# EasyEDA Pro project 14届蓝桥杯省赛真题.epro

# Schematic B1

## Sheets
1 ETH: Create Date: 2023-03-16; Page Name: ETH; Project Name: 14省赛; Schematic Name: B1; Update Date: 2023-05-20
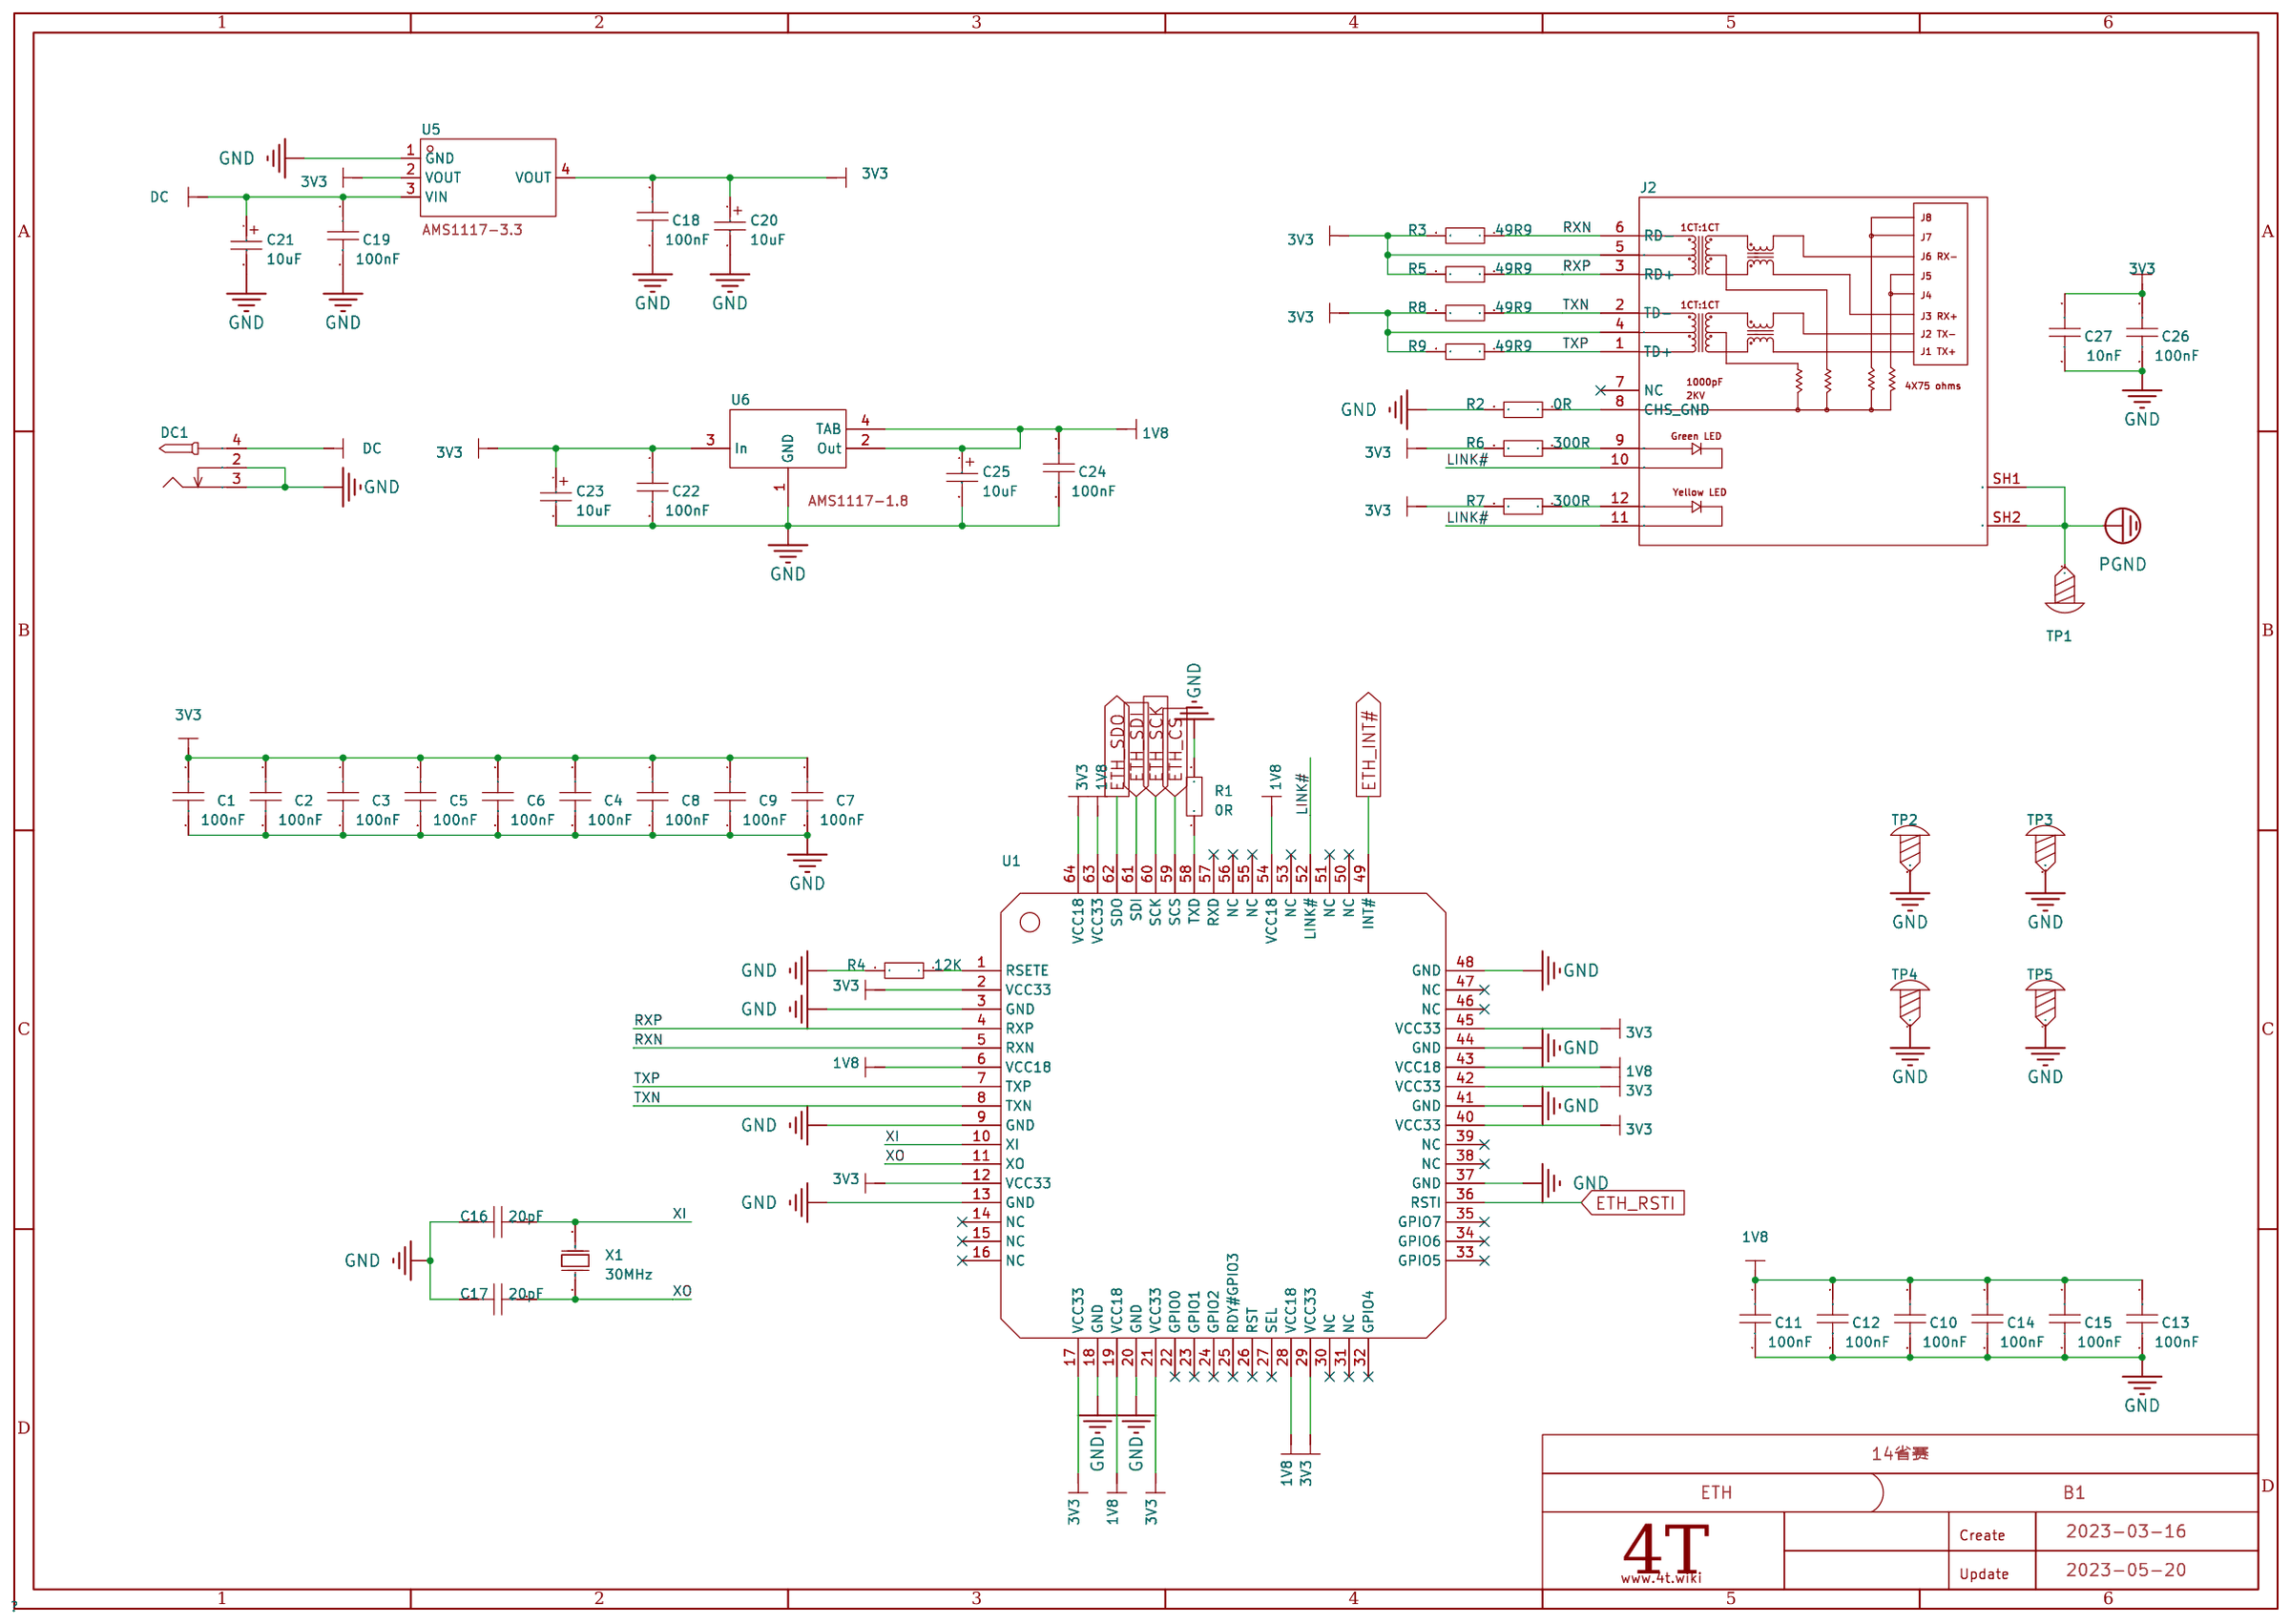
[diagram p0: ETH]
2 MP: Page Name: MP
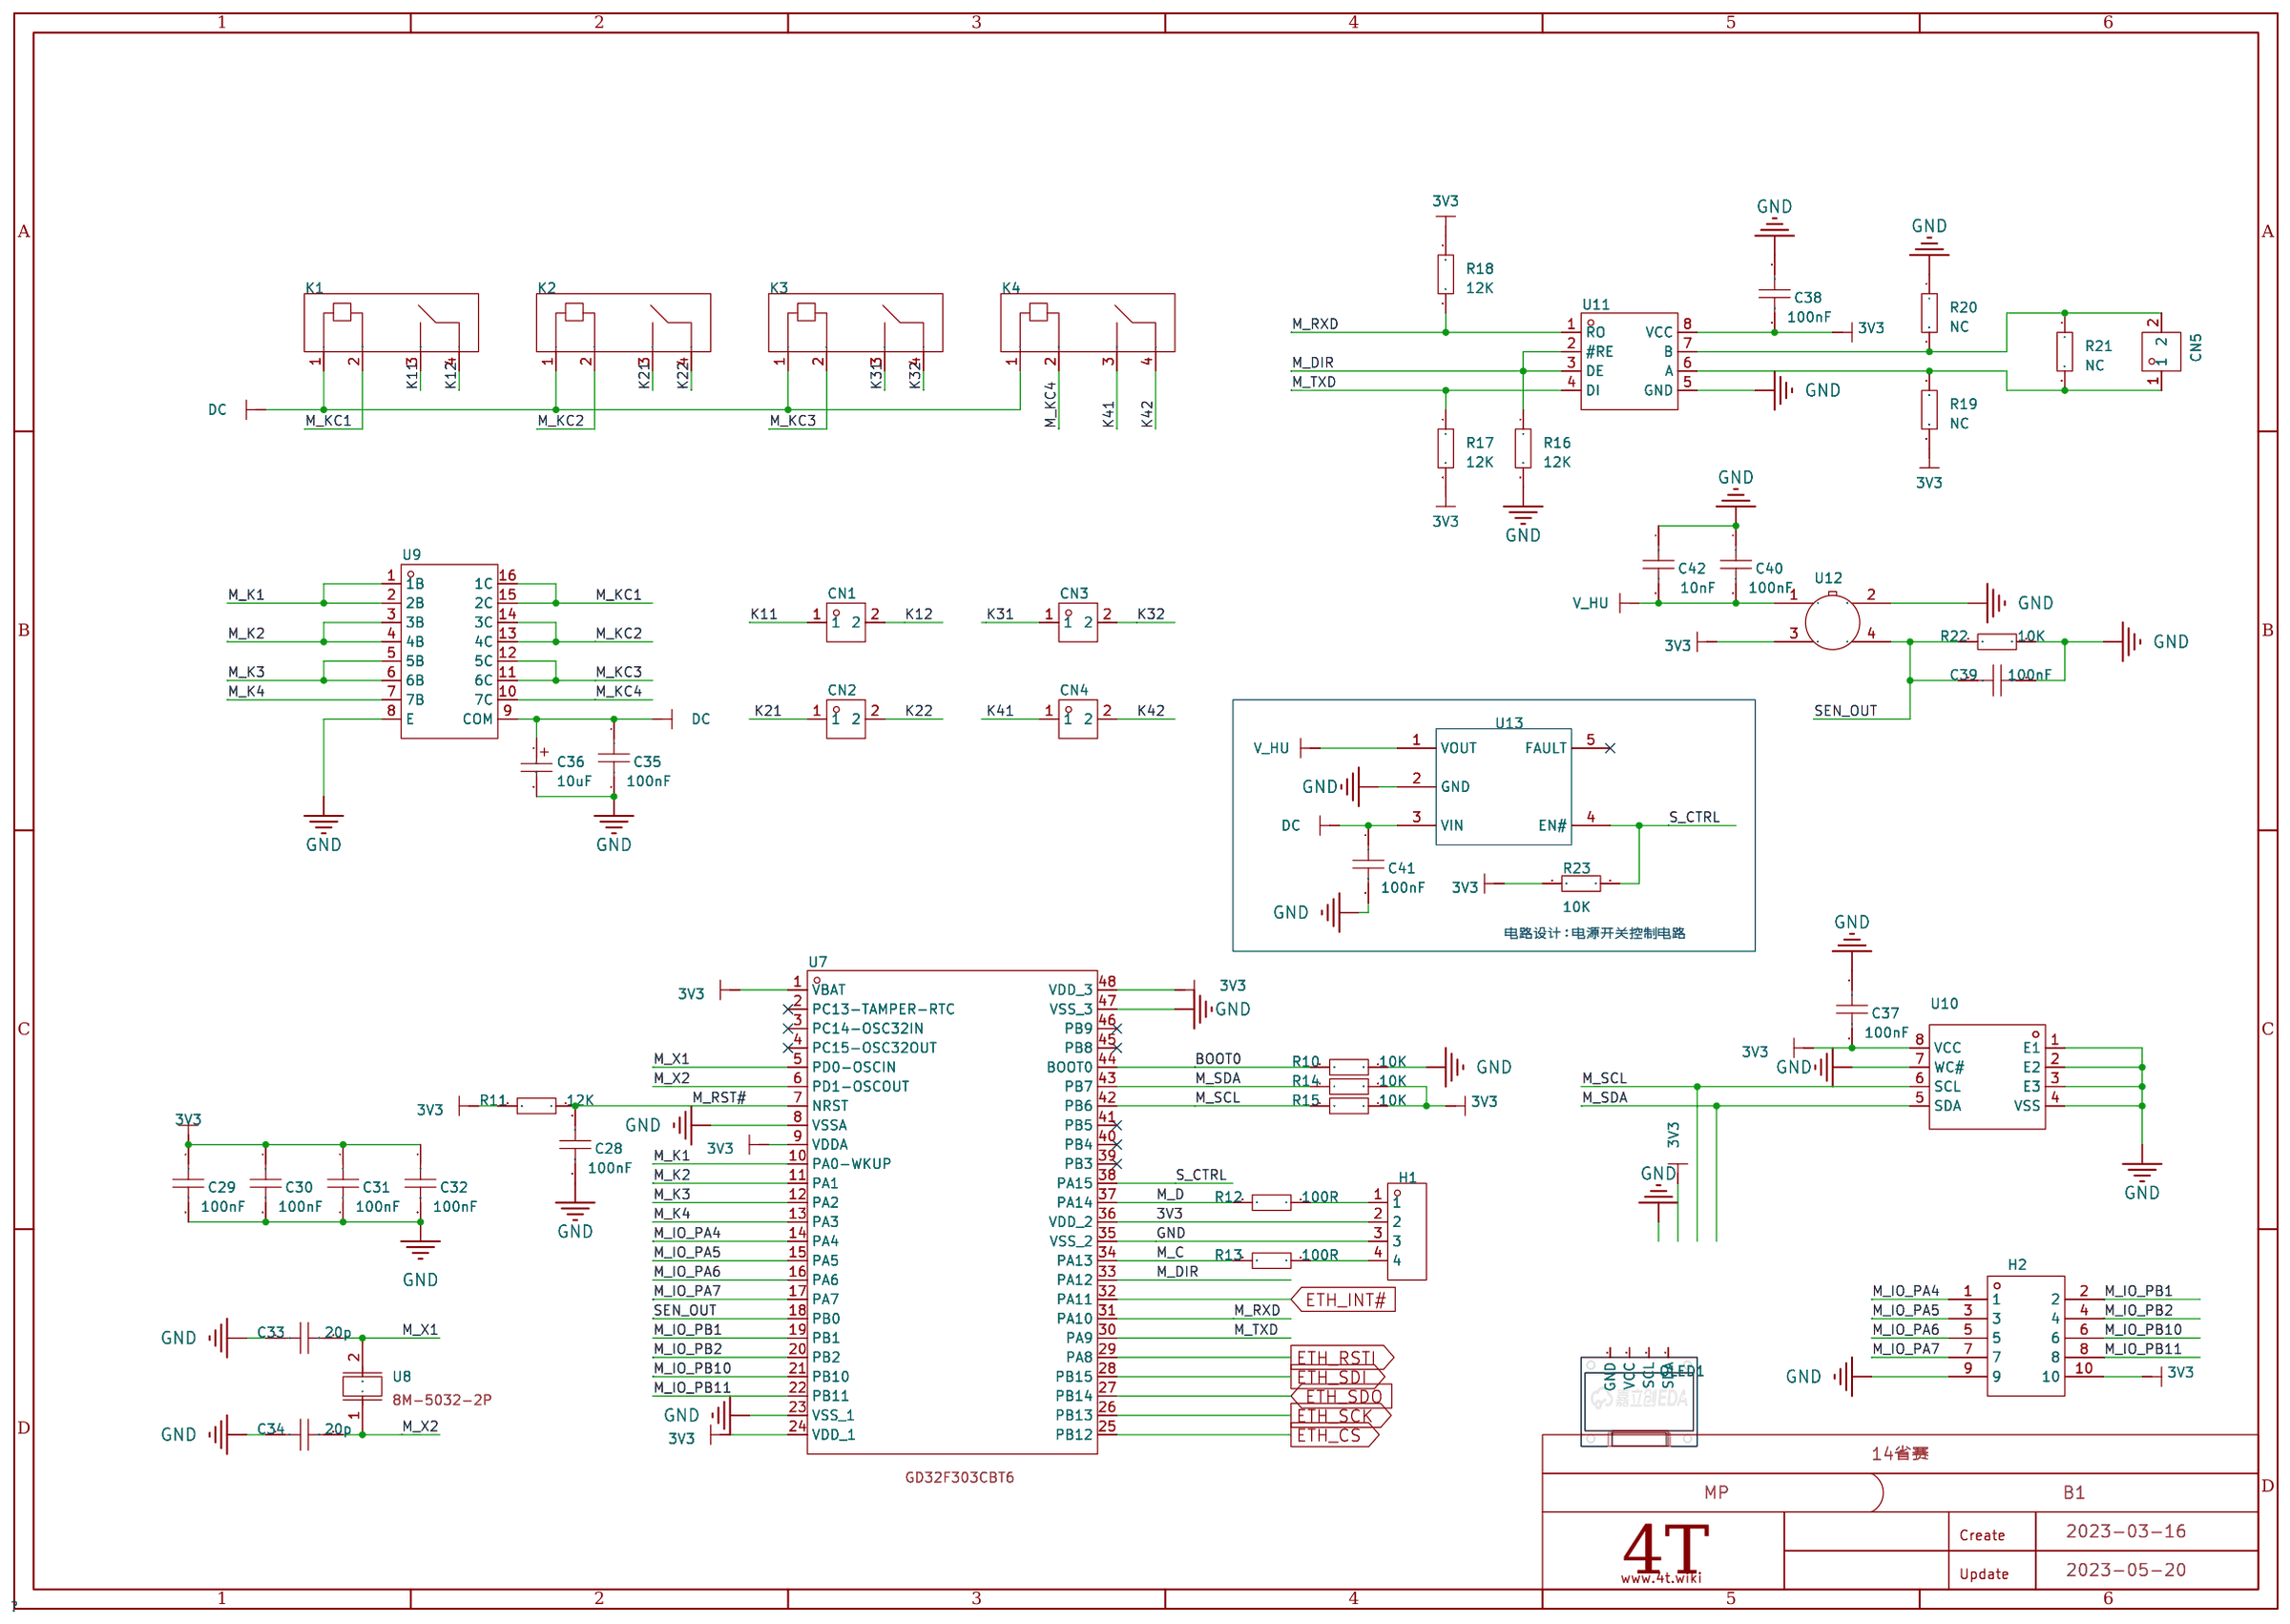
[diagram p1: MP]

## Parts
sheet ETH
C1  100nF  [C0805]
C2  100nF  [C0805]
C3  100nF  [C0805]
C4  100nF  [C0805]
C5  100nF  [C0805]
C6  100nF  [C0805]
C7  100nF  [C0805]
C8  100nF  [C0805]
C9  100nF  [C0805]
C10  100nF  [C0805]
C11  100nF  [C0805]
C12  100nF  [C0805]
C13  100nF  [C0805]
C14  100nF  [C0805]
C15  100nF  [C0805]
C16  20pF  [C0805]
C17  20pF  [C0805]
C18  100nF  [C0805]
C19  100nF  [C0805]
C20  10uF  [C_Ele_SMD_3x5.4mm]
C21  10uF  [C_Ele_SMD_3x5.4mm]
C22  100nF  [C0805]
C23  10uF  [C_Ele_SMD_3x5.4mm]
C24  100nF  [C0805]
C25  10uF  [C_Ele_SMD_3x5.4mm]
C26  100nF  [C0805]
C27  10nF  [C0805]
DC1  -  [DC-2.0]
J2  HY911105AE  [RJ45-TH_HR911105A]
R1  0R  [R0805]
R2  0R  [R0805]
R3  49R9  [R0805]
R4  12K  [R0805]
R5  49R9  [R0805]
R6  300R  [R0805]
R7  300R  [R0805]
R8  49R9  [R0805]
R9  49R9  [R0805]
TP1  -  [M3螺丝]
TP2  -  [M2螺丝]
TP3  -  [M2螺丝]
TP4  -  [M2螺丝]
TP5  -  [M2螺丝]
U1  CH395Q  [LQFP-64_L10.0-W10.0-P0.50-LS12.0-BL]
U5  AMS1117-3.3  [SOT-223-3_L6.5-W3.4-P2.30-LS7.0-BR]
U6  AMS1117-1.8  [SOT-223-4_L6.5-W3.5-P2.30-LS7.0-BR]
X1  30MHz  [OSC-SMD_L5.0-W3.2]
sheet MP
C28  100nF  [C0805]
C29  100nF  [C0805]
C30  100nF  [C0805]
C31  100nF  [C0805]
C32  100nF  [C0805]
C33  20p  [C0805]
C34  20p  [C0805]
C35  100nF  [C0805]
C36  10uF  [C_Ele_SMD_3x5.4mm]
C37  100nF  [C0805]
C38  100nF  [C0805]
C39  100nF  [C0805]
C40  100nF  [C0805]
C41  100nF  [C0805]
C42  10nF  [C0805]
CN1  KF128L-5.08-2P 蓝色  [TH_KF128L-5.08-2P]
CN2  KF128L-5.08-2P 蓝色  [TH_KF128L-5.08-2P]
CN3  KF128L-5.08-2P 蓝色  [TH_KF128L-5.08-2P]
CN4  KF128L-5.08-2P 蓝色  [TH_KF128L-5.08-2P]
CN5  KF128L-5.08-2P 蓝色  [TH_KF128L-5.08-2P]
H1  -  [HDR-TH_4P-P2.54-V-F]
H2  -  [HDR-TH_10P-P2.54-V-M-R2-C5-S2.54]
K1  HF49FD/012-1H12  [RELAY-TH_HF49FD-XXX-1H12-XXX]
K2  HF49FD/012-1H12  [RELAY-TH_HF49FD-XXX-1H12-XXX]
K3  HF49FD/012-1H12  [RELAY-TH_HF49FD-XXX-1H12-XXX]
K4  HF49FD/012-1H12  [RELAY-TH_HF49FD-XXX-1H12-XXX]
OLED1  -  [0.96OLED_4P]
R10  10K  [R0805]
R11  12K  [R0805]
R12  100R  [R0805]
R13  100R  [R0805]
R14  10K  [R0805]
R15  10K  [R0805]
R16  12K  [R0805]
R17  12K  [R0805]
R18  12K  [R0805]
R19  NC  [R0805]
R20  NC  [R0805]
R21  NC  [R0805]
R22  10K  [R0805]
R23  10K  [R0805]
U7  GD32F303CBT6  [LQFP-48_L7.0-W7.0-P0.50-LS9.0-BL]
U8  8M-5032-2P  [CRYSTAL-SMD_L5.0-W3.2]
U9  ULN2003  [SOIC-16_L9.9-W3.9-P1.27-LS6.0-BL]
U10  M24C02-WMN6TP  [SOIC-8_L4.9-W3.9-P1.27-LS6.0-BL]
U11  MAX3485ESA  [SOP-8_L5.0-W4.0-P1.27-LS6.0-BL]
U12  MP-2  [SENSOR-TH_MP-5]
U13  -  [SOT_PDS]

## Library data of the parts
C1-C19 C22 C24 C26-C35 C37-C42 = CAP_0603: Supplier Footprint: 0603
C20 C21 C23 C25 C36 = C_Ele_SMD_3x5.4mm: Supplier Footprint: SMD,3x5.4mm
DC1 = DC-005_2.0: Supplier Footprint: 插件
J2 = HY911105AE: 连接器类型:RJ插座;USOC代码:RJ45;端口数量:1;等级:-;屏蔽:-;LED:-;; LCSC Part Name: RJ45 带变压器; Supplier Part: C69427; Manufacturer: HANRUN(汉仁); Supplier Footprint: 插件; JLCPCB Part Class: 扩展库; Datasheet: https://atta.szlcsc.com/upload/public/pdf/source/20160507/1462613611469.pdf; Supplier: LCSC; Connector Type: RJ插座; USOC Codes: RJ45; Number of Ports: 1
R1-R23 = Res_0805: Supplier Footprint: 0805
TP1 = M3螺丝: Supplier Footprint: 插件
TP2-TP5 = M2螺丝: Supplier Footprint: 插件
U1 = CH395Q: 应用功能:以太网控制器;通道数:-;接口类型:Parallel, SPI, UART;电源电压:1.65V~3.6V;电源电流:90mA;; Supplier Part: C87390; Manufacturer: WCH(南京沁恒); Supplier Footprint: LQFP-64(10x10); JLCPCB Part Class: 扩展库; Datasheet: https://atta.szlcsc.com/upload/public/pdf/source/20200903/C87390_2BA27438C515B4B897A780BE99160E01.pdf; Supplier: LCSC; Application Function: 以太网控制器; Interface: Parallel, SPI, UART; Supply Voltage: 1.65V~3.6V; Supply Current: 90mA
U5 = AMS1117-3.3_C6186: 输出类型:固定;输出极性:正;输出通道数:1;最大输入电压:-;输出电压:3.3V;压差:1.3V@(800mA);静态电流(地电流):-;输出电流:1A;电源纹波抑制比(PSRR):72dB@(120Hz);噪声:-;特性:-;工作温度:-;; LCSC Part Name: 正 Vout=3.3V 1A 72dB@(120Hz); Supplier Part: C6186; Manufacturer: AMS; Supplier Footprint: SOT-223-3; JLCPCB Part Class: 基础库; Datasheet: https://atta.szlcsc.com/upload/public/pdf/source/20180727/C6186_7A095716F0823C02F1997A905E26C086.pdf; Supplier: LCSC; Output Type: 固定; Output Polarity: 正; Number of Outputs: 1; Output Voltage: 3.3V; Dropout Voltage: 1.3V@(800mA); Output Current: 1A; Power Supply Rejection Ratio (PSRR): 72dB@(120Hz)
U6 = AMS1117-1.8_C6185: 输出类型:固定;输出极性:正;输出通道数:1;最大输入电压:15V;输出电压:1.8V~1.8V;压差:1.3V@(1A);输出电流:1A;电源纹波抑制比(PSRR):75dB@(120Hz);; LCSC Part Name: 正 Vin=15V Vout=1.8V~1.8V 1A 75dB@(120Hz); Supplier Part: C6185; Manufacturer: AMS; Supplier Footprint: SOT-223-4; JLCPCB Part Class: 扩展库; Datasheet: https://atta.szlcsc.com/upload/public/pdf/source/20180727/C6186_7A095716F0823C02F1997A905E26C086.pdf; Supplier: LCSC; Output Type: 固定; Output Polarity: 正; Number of Outputs: 1; Maximum Input Voltage: 15V; Output Voltage: 1.8V~1.8V; Dropout Voltage: 1.3V@(1A); Output Current: 1A; Power Supply Rejection Ratio (PSRR): 75dB@(120Hz)
X1 = X503230MSB2GI: 晶振类型:贴片无源晶振;频率:30MHz;频率公差:±10ppm;频率稳定度:±50ppm;负载电容:20pF;工作温度:-40℃~+85℃;; LCSC Part Name: YSX530GA 30MHz ±10ppm 20pF; Supplier Part: C112563; Manufacturer: YXC(扬兴晶振); Supplier Footprint: SMD5032-2P; JLCPCB Part Class: 扩展库; Datasheet: https://atta.szlcsc.com/upload/public/pdf/source/20210329/C112559_847D3CACBA33ACCEB57DEA3AEBB187A1.pdf; Supplier: LCSC; Crystal Type: 贴片无源晶振; Frequency Tolerance: ±10ppm; Frequency Stability: ±50ppm; Load Capacitance: 20pF; Operating Temperature: -40℃~+85℃
CN1-CN5 = KF128L-5.08-2P 蓝色: Supplier Part: C2916931; Supplier Footprint: 5.08-2P; JLCPCB Part Class: 扩展库; Supplier: LCSC
H1 = HDR-F_2.54_1x4P: Supplier Part: C2718488; Supplier Footprint: 插件
H2 = HDR-M_2.54_2x5: Supplier Part: C124387; Supplier Footprint: 插件,P=2.54mm
K1-K4 = HF49FD/012-1H12: 线圈电压:12V;线圈类型:非极化-单线圈;触点形式:一组常开:1A(单刀单掷-常开);最大切换电流:5A;触点材料:AgNi;; LCSC Part Name: 宏发继电器; Supplier Part: C399491; Manufacturer: HF(宏发); Supplier Footprint: SIP-4; JLCPCB Part Class: 扩展库; Datasheet: https://atta.szlcsc.com/upload/public/pdf/source/20190620/C399491_B2190B02DDD565265172868420E7880D.pdf; Supplier: LCSC; Coil Voltage: 12V; Coil Type: 非极化-单线圈; Pin Number: 4; Contact Form: 一组常开:1A(单刀单掷-常开); Maximum Switching Current: 5A; Maximum Switching Voltage: 250V@AC；30V@DC; Coil Rated Power: 120mW; Contact Rating: 5A@30VDC；5A@250VAC; Coil Resistance: 1.2kΩ; Operate Time: 10ms; Release Time: 5ms; Contact Resistance: 100mΩ; Contact Material: AgNi; Operating Temperature: -40℃~+85℃
OLED1 = 0.96OLED模块_4P: Supplier Footprint: 插件
U7 = GD32F303CBT6_C3013779: CPU内核:ARM Cortex-M4;CPU最大主频:120MHz;工作电压范围:-;程序存储容量:128KB;RAM总容量:32KB;EEPROM/数据 FLASH容量:128KB;GPIO端口数量:37;ADC(位数):12bit;DAC(位数):12bit;(E)PWM(位数):-;8位Timer数量:-;16位Timer数量:7;32位Timer数量:-;CAN路数:1;U(S)ART路数:3;I2C路数:2;I2S路数:2;(Q)SPI路数:3;外设/功能:看门狗；RTC实时时钟;内部振荡器:; LCSC Part Name: ARM Cortex-M4 120MHz; Supplier Part: C3013779; Manufacturer: GigaDevice(兆易创新); Supplier Footprint: LQFP-48(7x7); JLCPCB Part Class: 扩展库; Datasheet: https://atta.szlcsc.com/upload/public/pdf/source/20220624/E1A57ED816B162D6D1424864911A792F.pdf; Supplier: LCSC; CPU Core: ARM Cortex-M4; CPU Maximum Speed: 120MHz; Program Storage Size: 128KB; Program Memory Type: FLASH; RAM Size: 32KB; EEPROM: 128KB; GPIO Ports Number: 37; ADC (Bit): 12bit; DAC (Bit): 12bit; 16Bit Timer: 7; CAN: 1; UART/USART: 3; I2C: 2; I2S: 2; SPI: 3; Peripheral/Function: 看门狗；RTC实时时钟; Watchdog: 有; Real-Time Clock: 有
U8 = 8M-5032-2P: Supplier Part: C9900017580; Supplier Footprint: 8MHz; JLCPCB Part Class: 扩展库; Supplier: LCSC
U9 = ULN2003: 开态输入电压(VI(on)@Vce,Ic):3V@2V,300mA;集射极饱和压降(VCE(sat)@Ii,Ic):1.2V@500uA,350mA;输出漏电流(Icex@Vce):50uA@50V;开态输入电流(Ii@Vi):-;关态输入电流(Ii(off)@Vce,Ic):65uA@50V,500uA;嵌位二极管漏电流(IR@VR):50uA@50V;嵌位二极管正向压降(VF@IF):1.7V@350mA;输入电容(Ci):15pF;工作温度:-20℃~+85℃;; Supplier Part: C688859; Manufacturer: IDCHIP(英锐芯); Supplier Footprint: SOIC-16; JLCPCB Part Class: 扩展库; Datasheet: https://atta.szlcsc.com/upload/public/pdf/source/20210302/C688859_5C67C6CBB0EA78EF92AFC966B53E1AD0.pdf; Supplier: LCSC; ON-state input   voltage(VI(on)@Vce,Ic): 3V@2V,300mA; Collector-emitter   saturation voltage (VCE(sat)@Ii,Ic): 1.2V@500uA,350mA; Output leakage current (Icex@Vce): 50uA@50V; Off-state input current (Ii(off)@Vce,Ic): 65uA@50V,500uA; Clamp Diode Leakage Current (IR@VR): 50uA@50V; Clamp Diode Forward Voltage (VF@IF): 1.7V@350mA; Input Capacitance (Ci): 15pF; Operating Temperature: -20℃~+85℃
U10 = M24C02-WMN6TP: 2-Kbit(256 x 8bit)，I2C接口，工作电压：2.5V to 5.5V; Supplier Part: C7562; Manufacturer: ST(意法半导体); Supplier Footprint: SOIC-8; JLCPCB Part Class: 基础库; Datasheet: https://atta.szlcsc.com/upload/public/pdf/source/20140724/1457707167301.pdf; Supplier: LCSC
U11 = MAX3485ESA: Supplier Part: C668204; Manufacturer: UMW(广东友台半导体); Supplier Footprint: SOP-8; JLCPCB Part Class: 扩展库; Datasheet: https://atta.szlcsc.com/upload/public/pdf/source/20221009/BC018EFD0F414E24649E284F574E449C.pdf; Supplier: LCSC
U12 = MP-2: Supplier Part: C242497; Manufacturer: Winsen(炜盛); Supplier Footprint: 插件; JLCPCB Part Class: 扩展库; Datasheet: https://atta.szlcsc.com/upload/public/pdf/source/20180704/C242497_B8D2418C2743DA3210851F2FB82DA8BD.pdf; Supplier: LCSC
U13 = PDS: JLCPCB Part Class: 扩展库

## Nets
1V8: C10.1 C11.1 C12.1 C13.1 C14.1 C15.1 C24.1 C25.1 U1.6(VCC18) U1.19(VCC18) U1.28(VCC18) U1.43(VCC18) U1.54(VCC18) U1.63(VCC33) U6.2(Out) U6.4(TAB)
3V3: C1.1 C2.1 C3.1 C4.1 C5.1 C6.1 C7.1 C8.1 C9.1 C18.1 C20.1 C22.1 C23.1 C26.1 C27.1 C29.1 C30.1 C31.1 C32.1 C37.2 C38.2 H1.2 H2.10 J2.4 J2.5 R3.2 R5.2 R6.2 R7.2 R8.2 R9.2 R11.2 R14.2 R15.1 R17.2 R18.1 R19.2 R23.1 U1.2(VCC33) U1.12(VCC33) U1.17(VCC33) U1.21(VCC33) U1.29(VCC33) U1.40(VCC33) U1.42(VCC33) U1.45(VCC33) U1.64(VCC18) U5.2(VOUT) U5.4(VOUT) U6.3(In) U7.1(VBAT) U7.9(VDDA) U7.24(VDD_1) U7.36(VDD_2) U7.48(VDD_3) U10.8(VCC) U11.8(VCC) U12.3
GND: C1.2 C2.2 C3.2 C4.2 C5.2 C6.2 C7.2 C8.2 C9.2 C10.2 C11.2 C12.2 C13.2 C14.2 C15.2 C16.1 C17.1 C18.2 C19.2 C20.2 C21.2 C22.2 C23.2 C24.2 C25.2 C26.2 C27.2 C28.2 C29.2 C30.2 C31.2 C32.2 C33.1 C34.1 C35.2 C36.2 C37.1 C38.1 C39.2 C40.1 C41.2 C42.1 DC1.2 DC1.3 H1.3 H2.9 R1.2 R2.2 R4.2 R10.1 R16.2 R20.1 R22.2 TP2.1 TP3.1 TP4.1 TP5.1 U1.3(GND) U1.9(GND) U1.13(GND) U1.18(GND) U1.20(GND) U1.37(GND) U1.41(GND) U1.44(GND) U1.48(GND) U5.1(GND) U6.1(GND) U7.8(VSSA) U7.23(VSS_1) U7.35(VSS_2) U7.47(VSS_3) U9.8(E) U10.1(E1) U10.2(E2) U10.3(E3) U10.4(VSS) U10.7(WC#) U11.5(GND) U12.2 U13.2(GND)
PGND: J2.SH1 J2.SH2 TP1.1
BOOT0: R10.2 U7.44(BOOT0)
DC: C19.1 C21.1 C35.1 C36.1 C41.1 DC1.4 K1.1 K2.1 K3.1 K4.1 U5.3(VIN) U9.9(COM) U13.3(VIN)
ETH_CS: U1.59(SCS) U7.25(PB12)
ETH_INT#: U1.49(INT#) U7.32(PA11)
ETH_RSTI: U1.36(RSTI) U7.29(PA8)
ETH_SCK: U1.60(SCK) U7.26(PB13)
ETH_SDI: U1.61(SDI) U7.28(PB15)
ETH_SDO: U1.62(SDO) U7.27(PB14)
K11: CN1.1 K1.3
K12: CN1.2 K1.4
K21: CN2.1 K2.3
K22: CN2.2 K2.4
K31: CN3.1 K3.3
K32: CN3.2 K3.4
K41: CN4.1 K4.3
K42: CN4.2 K4.4
LINK#: J2.10 J2.11 U1.52(LINK#)
M_C: R13.2 U7.34(PA13)
M_D: R12.2 U7.37(PA14)
M_DIR: R16.1 U7.33(PA12) U11.2(#RE) U11.3(DE)
M_IO_PA4: H2.1 U7.14(PA4)
M_IO_PA5: H2.3 U7.15(PA5)
M_IO_PA6: H2.5 U7.16(PA6)
M_IO_PA7: H2.7 U7.17(PA7)
M_IO_PB1: H2.2 U7.19(PB1)
M_IO_PB2: H2.4 U7.20(PB2)
M_IO_PB10: H2.6 U7.21(PB10)
M_IO_PB11: H2.8 U7.22(PB11)
M_K1: U7.10(PA0-WKUP) U9.1(1B) U9.2(2B)
M_K2: U7.11(PA1) U9.3(3B) U9.4(4B)
M_K3: U7.12(PA2) U9.5(5B) U9.6(6B)
M_K4: U7.13(PA3) U9.7(7B)
M_KC1: K1.2 U9.15(2C) U9.16(1C)
M_KC2: K2.2 U9.13(4C) U9.14(3C)
M_KC3: K3.2 U9.11(6C) U9.12(5C)
M_KC4: K4.2 U9.10(7C)
M_RST#: C28.1 R11.1 U7.7(NRST)
M_RXD: R18.2 U7.31(PA10) U11.1(RO)
M_SCL: R15.2 U7.42(PB6) U10.6(SCL)
M_SDA: R14.1 U7.43(PB7) U10.5(SDA)
M_TXD: R17.1 U7.30(PA9) U11.4(DI)
M_X1: C33.2 U7.5(PD0-OSCIN) U8.2
M_X2: C34.2 U7.6(PD1-OSCOUT) U8.1
RXN: J2.6(RD-) R3.1 U1.5(RXN)
RXP: J2.3(RD+) R5.1 U1.4(RXP)
S_CTRL: R23.2 U7.38(PA15) U13.4(EN#)
SEN_OUT: C39.1 R22.1 U7.18(PB0) U12.4
TXN: J2.2(TD-) R8.1 U1.8(TXN)
TXP: J2.1(TD+) R9.1 U1.7(TXP)
V_HU: C40.2 C42.2 U12.1 U13.1(VOUT)
XI: C16.2 U1.10(XI) X1.2(OSC2)
XO: C17.2 U1.11(XO) X1.1(OSC1)
$1N6890: R4.1 U1.1(RSETE)
$1N7627: R1.1 U1.58(TXD)
$1N10654: J2.8(CHS GND) R2.1
$1N10919: J2.12 R7.1
$1N10952: J2.9 R6.1
$2N5291: H1.1 R12.1
$2N5344: H1.4 R13.1
$2N14954: CN5.2 R20.2 R21.1 U11.7(B)
$2N14989: CN5.1 R19.1 R21.2 U11.6(A)

Not connected (* = marked no-connect by the designer): J2 7(NC)*; OLED1 1(GND) 2(VCC) 3(SCL) 4(SDA); U1 14(NC)* 15(NC)* 16(NC)* 22(GPIO0)* 23(GPIO1)* 24(GPIO2)* 25(RDY#GPIO3)* 26(RST)* 27(SEL)* 30(NC)* 31(NC)* 32(GPIO4)* 33(GPIO5)* 34(GPIO6)* 35(GPIO7)* 38(NC)* 39(NC)* 46(NC)* 47(NC)* 50(NC)* 51(NC)* 53(NC)* 55(NC)* 56(NC)* 57(RXD)*; U7 2(PC13-TAMPER-RTC)* 3(PC14-OSC32IN)* 4(PC15-OSC32OUT)* 39(PB3)* 40(PB4)* 41(PB5)* 45(PB8)* 46(PB9)*; U13 5(FAULT)*

## Notes on the sheets
sheet 2
- 电路设计：电源开关控制电路

# Board B1
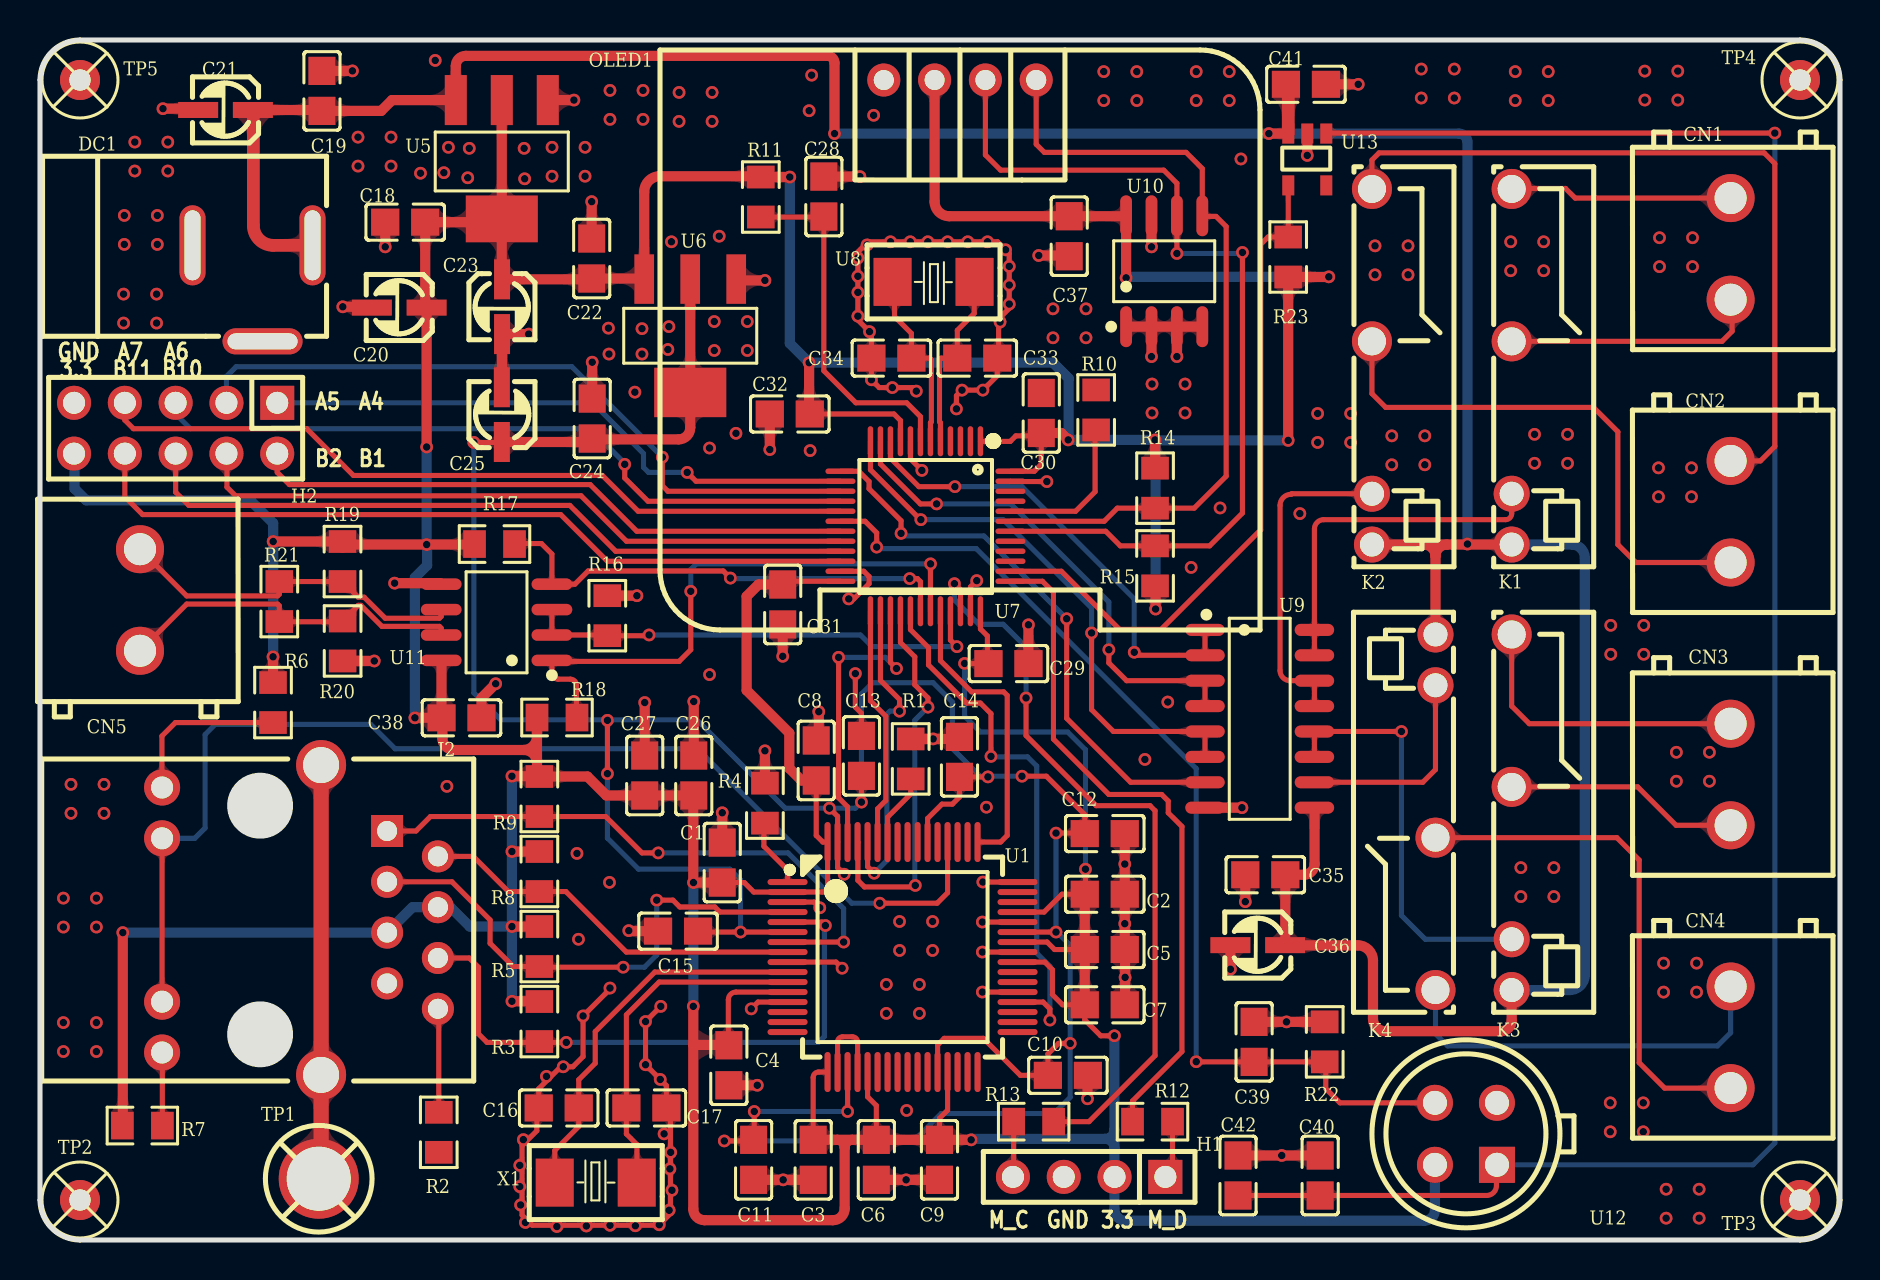
[diagram p2: board, top side]
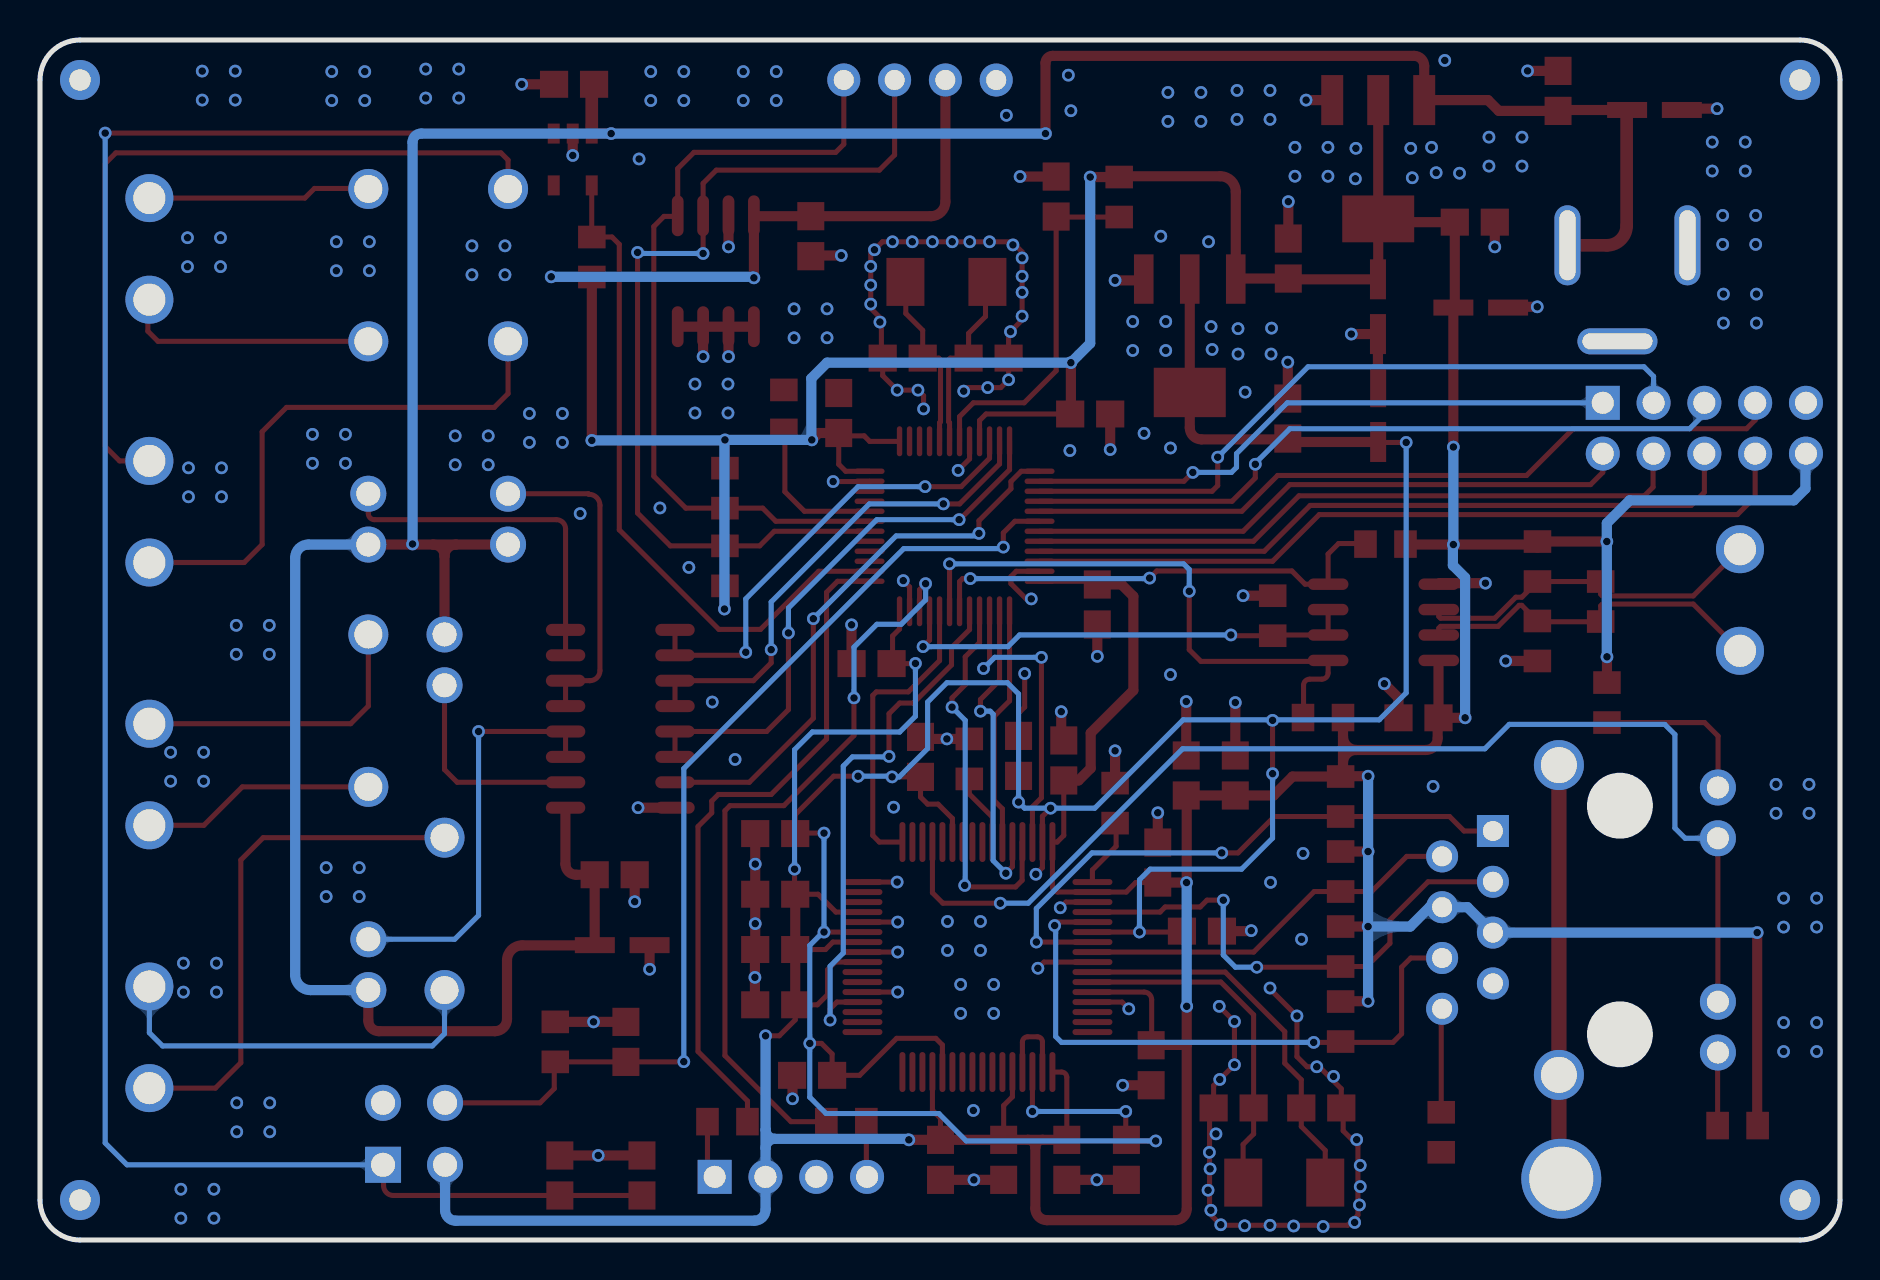
[diagram p3: board, bottom side, seen from below]

Outline 90 x 60 mm; copper layers: Top Layer, Bottom Layer. Coordinates in mm from the lower left corner of the outline.
Outline path: 0,58 0,2 arc(0.59,0.59) 2,0 88,0 arc(89.41,0.59) 90,2 90,58 arc(89.41,59.41) 88,60 2,60 arc(0.59,59.41) 0,58
Stack: Top Layer 0.035mm / Dielectric1 1.51mm FR4 er 4.5 / Bottom Layer 0.035mm

## Design rules (mm)
net M_X1: DP1
net M_X2: DP1
net $2N14954: DP2
net $2N14989: DP2
template: 用户自定义配置
spacing safeClearance (default): track to track 0.203, other pairs 0.152 to 0.203
track width trackWidth (default): min 0.254, default 0.254, max 2.54
track width pwr: min 0.254, default 0.508, max 2.54
differential pair differentialPair (default): width min 0.127, default 0.254, max 2.54; gap min 0.152, default 0.152
via viaSize (default): diameter min 0.635, default 0.635, max 10; hole min 0.381, default 0.381, max 5.999
net 3V3 uses pwr
net GND uses pwr
net 1V8 uses pwr
net DC uses pwr

## Placement (name value [footprint] x y rotation side)
C1  100nF  [C0805]  34.11 18.87 90 top
C2  100nF  [C0805]  53.24 17.29 0 top
C3  100nF  [C0805]  38.66 4.01 270 top
C4  100nF  [C0805]  34.44 8.74 270 top
C5  100nF  [C0805]  53.24 14.52 0 top
C6  100nF  [C0805]  41.82 4.01 270 top
C7  100nF  [C0805]  53.24 11.76 0 top
C8  100nF  [C0805]  38.81 23.98 90 top
C9  100nF  [C0805]  44.97 4.01 270 top
C10  100nF  [C0805]  51.39 8.23 0 top
C11  100nF  [C0805]  35.68 4.01 270 top
C12  100nF  [C0805]  53.24 20.32 0 top
C13  100nF  [C0805]  41.07 24.21 90 top
C14  100nF  [C0805]  45.97 24.16 90 top
C15  100nF  [C0805]  31.9 15.44 180 top
C16  20pF  [C0805]  25.94 6.6 0 top
C17  20pF  [C0805]  30.32 6.6 180 top
C18  100nF  [C0805]  18.26 50.89 180 top
C19  100nF  [C0805]  14.1 57.45 90 top
C20  10uF  [C_Ele_SMD_3x5.4mm]  17.96 46.63 0 top
C21  10uF  [C_Ele_SMD_3x5.4mm]  9.27 56.52 0 top
C22  100nF  [C0805]  27.58 49.07 90 top
C23  10uF  [C_Ele_SMD_3x5.4mm]  23.09 46.66 90 top
C24  100nF  [C0805]  27.61 41.07 90 top
C25  10uF  [C_Ele_SMD_3x5.4mm]  23.11 41.28 270 top
C26  100nF  [C0805]  32.69 23.23 90 top
C27  10nF  [C0805]  30.24 23.23 90 top
C28  100nF  [C0805]  39.19 52.17 90 top
C29  100nF  [C0805]  48.42 28.82 0 top
C30  100nF  [C0805]  50.06 41.35 90 top
C31  100nF  [C0805]  37.13 31.78 270 top
C32  100nF  [C0805]  37.49 41.3 180 top
C33  20p  [C0805]  46.87 44.09 180 top
C34  20p  [C0805]  42.57 44.09 0 top
C35  100nF  [C0805]  61.26 18.26 180 top
C36  10uF  [C_Ele_SMD_3x5.4mm]  60.88 14.76 0 top
C37  100nF  [C0805]  51.46 50.19 90 top
C38  100nF  [C0805]  21.08 26.11 180 top
C39  100nF  [C0805]  60.71 9.91 90 top
C40  100nF  [C0805]  64.01 3.23 270 top
C41  100nF  [C0805]  63.3 57.78 0 top
C42  10nF  [C0805]  59.9 3.23 270 top
CN1  KF128L-5.08-2P 蓝色  [TH_KF128L-5.08-2P]  84.53 49.56 90 top
CN2  KF128L-5.08-2P 蓝色  [TH_KF128L-5.08-2P]  84.53 36.42 90 top
CN3  KF128L-5.08-2P 蓝色  [TH_KF128L-5.08-2P]  84.53 23.28 90 top
CN4  KF128L-5.08-2P 蓝色  [TH_KF128L-5.08-2P]  84.53 10.13 90 top
CN5  KF128L-5.08-2P 蓝色  [TH_KF128L-5.08-2P]  5 32 270 top
DC1  -  [DC-2.0]  10.5 50 180 top
H1  -  [HDR-TH_4P-P2.54-V-F]  52.46 3.16 180 top
H2  -  [HDR-TH_10P-P2.54-V-M-R2-C5-S2.54]  6.78 40.59 180 top
J2  HY911105AE  [RJ45-TH_HR911105A]  13 16 270 top
K1  HF49FD/012-1H12  [RELAY-TH_HF49FD-XXX-1H12-XXX]  73.58 43.66 90 top
K2  HF49FD/012-1H12  [RELAY-TH_HF49FD-XXX-1H12-XXX]  66.6 43.66 90 top
K3  HF49FD/012-1H12  [RELAY-TH_HF49FD-XXX-1H12-XXX]  73.58 21.39 90 top
K4  HF49FD/012-1H12  [RELAY-TH_HF49FD-XXX-1H12-XXX]  69.77 21.39 270 top
OLED1  -  [0.96OLED_4P]  46 58 0 top
R1  0R  [R0805]  43.54 24.05 90 top
R2  0R  [R0805]  19.94 5.38 270 top
R3  49R9  [R0805]  24.97 10.92 90 top
R4  12K  [R0805]  36.25 21.84 90 top
R5  49R9  [R0805]  24.97 14.67 90 top
R6  300R  [R0805]  11.65 26.87 90 top
R7  300R  [R0805]  5.12 5.72 180 top
R8  49R9  [R0805]  24.97 18.42 90 top
R9  49R9  [R0805]  24.97 22.17 90 top
R10  10K  [R0805]  52.81 41.5 270 top
R11  12K  [R0805]  36.04 52.15 90 top
R12  100R  [R0805]  55.63 5.92 180 top
R13  100R  [R0805]  49.68 5.92 0 top
R14  10K  [R0805]  55.75 37.59 90 top
R15  10K  [R0805]  55.75 33.71 90 top
R16  12K  [R0805]  28.36 31.21 90 top
R17  12K  [R0805]  22.73 34.8 180 top
R18  12K  [R0805]  25.85 26.12 0 top
R19  NC  [R0805]  15.13 33.92 90 top
R20  NC  [R0805]  15.13 29.95 90 top
R21  NC  [R0805]  11.97 31.92 90 top
R22  10K  [R0805]  64.24 9.91 90 top
R23  10K  [R0805]  62.41 49.15 90 top
TP1  -  [M3螺丝]  14 3 0 top
TP2  -  [M2螺丝]  2 2 0 top
TP3  -  [M2螺丝]  88 2 0 top
TP4  -  [M2螺丝]  88 58 0 top
TP5  -  [M2螺丝]  2 58 0 top
U1  CH395Q  [LQFP-64_L10.0-W10.0-P0.50-LS12.0-BL]  43.13 14.15 270 top
U5  AMS1117-3.3  [SOT-223-3_L6.5-W3.4-P2.30-LS7.0-BR]  23.09 54.03 90 top
U6  AMS1117-1.8  [SOT-223-4_L6.5-W3.5-P2.30-LS7.0-BR]  32.51 45.21 90 top
U7  GD32F303CBT6  [LQFP-48_L7.0-W7.0-P0.50-LS9.0-BL]  44.27 35.69 180 top
U8  8M-5032-2P  [CRYSTAL-SMD_L5.0-W3.2]  44.68 47.9 0 top
U9  ULN2003  [SOIC-16_L9.9-W3.9-P1.27-LS6.0-BL]  60.99 26.06 270 top
U10  M24C02-WMN6TP  [SOIC-8_L4.9-W3.9-P1.27-LS6.0-BL]  56.21 48.44 0 top
U11  MAX3485ESA  [SOP-8_L5.0-W4.0-P1.27-LS6.0-BL]  22.83 30.88 90 top
U12  MP-2  [SENSOR-TH_MP-5]  71.3 5.31 90 top
U13  -  [SOT_PDS]  64.31 55.32 180 top
X1  30MHz  [OSC-SMD_L5.0-W3.2]  27.79 2.87 180 top

## Footprints (pads in the part's own frame, mm; a bottom-side part is the same pattern mirrored in y, then rotated)
0.96OLED_4P
  round 1.65 hole 1: 1(-3.81,-0.002) 2(-1.27,0.002) 3(1.27,0.002) 4(3.81,0.002)
C0805
  rect 1.41x1.35 smd: 1(-1,0) 2(1,0)
C_Ele_SMD_3x5.4mm
  rect 1.999x0.8 smd: 1(1.374,-0.014) 2(-1.364,-0.014)
CRYSTAL-SMD_L5.0-W3.2
  rect 1.9x2.4 smd: 1(-2.05,0) 2(2.05,0)
DC-2.0
  oval 4x1.3 hole 3.5x0.8: 2(-0.627,5.067)
  oval 1.3x4 hole 0.8x3.5: 3(2.873,0.267) 4(-3.127,0.267)
HDR-TH_4P-P2.54-V-F
  rect 1.7x1.7 hole 1.1: 1(-3.81,0)
  round 1.7 hole 1.1: 2(-1.27,0) 3(1.27,0) 4(3.81,0)
HDR-TH_10P-P2.54-V-M-R2-C5-S2.54
  rect 1.7x1.7 hole 1.1: 1(-5.08,-1.27)
  round 1.7 hole 1.1: 2(-5.08,1.27) 3(-2.54,-1.27) 4(-2.54,1.27) 5(0,-1.27) 6(0,1.27) 7(2.54,-1.27) 8(2.54,1.27) 9(5.08,-1.27) 10(5.08,1.27)
LQFP-48_L7.0-W7.0-P0.50-LS9.0-BL
  oval 0.27x1.5 smd: 1(-2.75,-4.25) 2(-2.25,-4.25) 3(-1.75,-4.25) 4(-1.25,-4.25) 5(-0.75,-4.25) 6(-0.25,-4.25) 7(0.25,-4.25) 8(0.75,-4.25) 9(1.25,-4.25) 10(1.75,-4.25) 11(2.25,-4.25) 12(2.75,-4.25) 25(2.75,4.25) 26(2.25,4.25) 27(1.75,4.25) 28(1.25,4.25) 29(0.75,4.25) 30(0.25,4.25) 31(-0.25,4.25) 32(-0.75,4.25) 33(-1.25,4.25) 34(-1.75,4.25) 35(-2.25,4.25) 36(-2.75,4.25)
  oval 1.5x0.27 smd: 13(4.25,-2.75) 14(4.25,-2.25) 15(4.25,-1.75) 16(4.25,-1.25) 17(4.25,-0.75) 18(4.25,-0.25) 19(4.25,0.25) 20(4.25,0.75) 21(4.25,1.25) 22(4.25,1.75) 23(4.25,2.25) 24(4.25,2.75) 37(-4.25,2.75) 38(-4.25,2.25) 39(-4.25,1.75) 40(-4.25,1.25) 41(-4.25,0.75) 42(-4.25,0.25) 43(-4.25,-0.25) 44(-4.25,-0.75) 45(-4.25,-1.25) 46(-4.25,-1.75) 47(-4.25,-2.25) 48(-4.25,-2.75)
LQFP-64_L10.0-W10.0-P0.50-LS12.0-BL
  oval 0.3x2 smd: 1(-3.75,-5.75) 2(-3.25,-5.75) 3(-2.75,-5.75) 4(-2.25,-5.75) 5(-1.75,-5.75) 6(-1.25,-5.75) 7(-0.75,-5.75) 8(-0.25,-5.75) 9(0.25,-5.75) 10(0.75,-5.75) 11(1.25,-5.75) 12(1.75,-5.75) 13(2.25,-5.75) 14(2.75,-5.75) 15(3.25,-5.75) 16(3.75,-5.75) 33(3.75,5.75) 34(3.25,5.75) 35(2.75,5.75) 36(2.25,5.75) 37(1.75,5.75) 38(1.25,5.75) 39(0.75,5.75) 40(0.25,5.75) 41(-0.25,5.75) 42(-0.75,5.75) 43(-1.25,5.75) 44(-1.75,5.75) 45(-2.25,5.75) 46(-2.75,5.75) 47(-3.25,5.75) 48(-3.75,5.75)
  oval 2x0.3 smd: 17(5.75,-3.75) 18(5.75,-3.25) 19(5.75,-2.75) 20(5.75,-2.25) 21(5.75,-1.75) 22(5.75,-1.25) 23(5.75,-0.75) 24(5.75,-0.25) 25(5.75,0.25) 26(5.75,0.75) 27(5.75,1.25) 28(5.75,1.75) 29(5.75,2.25) 30(5.75,2.75) 31(5.75,3.25) 32(5.75,3.75) 49(-5.75,3.75) 50(-5.75,3.25) 51(-5.75,2.75) 52(-5.75,2.25) 53(-5.75,1.75) 54(-5.75,1.25) 55(-5.75,0.75) 56(-5.75,0.25) 57(-5.75,-0.25) 58(-5.75,-0.75) 59(-5.75,-1.25) 60(-5.75,-1.75) 61(-5.75,-2.25) 62(-5.75,-2.75) 63(-5.75,-3.25) 64(-5.75,-3.75)
M2螺丝
  round 2 hole 1.07: 1(0,0)
M3螺丝
  round 4 hole 3.2: 1(-0.064,0.064)
OSC-SMD_L5.0-W3.2
  rect 1.9x2.4 smd: 1(-2.05,0) 2(2.05,0)
R0805
  rect 1.133x1.377 smd: 1(-1,0) 2(1,0)
RELAY-TH_HF49FD-XXX-1H12-XXX
  round 1.8 hole 1.2: 1(-8.89,0) 2(-6.35,0)
  round 2 hole 1.4: 3(1.27,0) 4(8.89,0)
RJ45-TH_HR911105A
  rect 1.6x1.6 hole 1: 1(-4.45,4.355)
  round 1.6 hole 1: 2(-3.18,6.895) 3(-1.91,4.355) 4(-0.64,6.895) 5(0.63,4.355) 6(1.9,6.895) 7(3.17,4.355) 8(4.44,6.895)
  round 1.8 hole 1.1: 9(-6.625,-6.895) 10(-4.085,-6.895) 11(4.085,-6.895) 12(6.625,-6.895)
  round 2.5 hole 1.8: SH1(-7.745,1.055) SH2(7.745,1.055)
SENSOR-TH_MP-5
  rect 1.8x1.8 hole 1.2: 1(-1.549,-1.55)
  round 1.8 hole 1.2: 2(1.55,-1.55) 3(-1.55,1.55) 4(1.55,1.55)
SOIC-8_L4.9-W3.9-P1.27-LS6.0-BL
  oval 0.588x2.045 smd: 1(-1.905,-2.772) 2(-0.635,-2.772) 3(0.635,-2.772) 4(1.905,-2.772) 5(1.905,2.772) 6(0.635,2.772) 7(-0.635,2.772) 8(-1.905,2.772)
SOIC-16_L9.9-W3.9-P1.27-LS6.0-BL
  oval 0.602x1.971 smd: 1(-4.445,-2.736) 2(-3.175,-2.736) 3(-1.905,-2.736) 4(-0.635,-2.736) 5(0.635,-2.736) 6(1.905,-2.736) 7(3.175,-2.736) 8(4.445,-2.736) 9(4.445,2.736) 10(3.175,2.736) 11(1.905,2.736) 12(0.635,2.736) 13(-0.635,2.736) 14(-1.905,2.736) 15(-3.175,2.736) 16(-4.445,2.736)
SOP-8_L5.0-W4.0-P1.27-LS6.0-BL
  oval 0.574x2.035 smd: 1(-1.905,-2.768) 2(-0.635,-2.768) 3(0.635,-2.768) 4(1.905,-2.768) 5(1.905,2.768) 6(0.635,2.768) 7(-0.635,2.768) 8(-1.905,2.768)
SOT-223-3_L6.5-W3.4-P2.30-LS7.0-BR
  rect 2.5x1.1 smd: 1(2.97,-2.3) 2(2.97,0) 3(2.97,2.3)
  rect 2.34x3.6 smd: 4(-2.97,0)
SOT-223-4_L6.5-W3.5-P2.30-LS7.0-BR
  rect 2.47x0.98 smd: 1(2.835,-2.3) 2(2.835,0) 3(2.835,2.3)
  rect 2.47x3.6 smd: 4(-2.835,0)
SOT_PDS
  rect 0.6x1 smd: 1(0,0) 2(0.95,0) 3(1.9,0) 4(1.9,2.59) 5(0,2.59)
TH_KF128L-5.08-2P
  round 2.4 hole 1.6: 1(-2.54,0) 2(2.54,0)

## Nets
As in the schematic, except:
3V3: C1.1 C2.1 C3.1 C4.1 C5.1 C6.1 C7.1 C8.1 C9.1 C18.1 C20.1 C22.1 C23.1 C26.1 C27.1 C29.1 C30.1 C31.1 C32.1 C37.2 C38.2 H1.2 H2.10 J2.4 J2.5 OLED1.2 R3.2 R5.2 R6.2 R7.2 R8.2 R9.2 R11.2 R14.2 R15.1 R17.2 R18.1 R19.2 R23.1 U1.2 U1.12 U1.17 U1.21 U1.29 U1.40 U1.42 U1.45 U1.64 U5.2 U5.4 U6.3 U7.1 U7.9 U7.24 U7.36 U7.48 U10.8 U11.8 U12.3
GND: C1.2 C2.2 C3.2 C4.2 C5.2 C6.2 C7.2 C8.2 C9.2 C10.2 C11.2 C12.2 C13.2 C14.2 C15.2 C16.1 C17.1 C18.2 C19.2 C20.2 C21.2 C22.2 C23.2 C24.2 C25.2 C26.2 C27.2 C28.2 C29.2 C30.2 C31.2 C32.2 C33.1 C34.1 C35.2 C36.2 C37.1 C38.1 C39.2 C40.1 C41.2 C42.1 DC1.2 DC1.3 H1.3 H2.9 OLED1.1 R1.2 R2.2 R4.2 R10.1 R16.2 R20.1 R22.2 TP2.1 TP3.1 TP4.1 TP5.1 U1.3 U1.9 U1.13 U1.18 U1.20 U1.37 U1.41 U1.44 U1.48 U5.1 U6.1 U7.8 U7.23 U7.35 U7.47 U9.8 U10.1 U10.2 U10.3 U10.4 U10.7 U11.5 U12.2 U13.2
M_SCL: OLED1.3 R15.2 U7.42 U10.6
M_SDA: OLED1.4 R14.1 U7.43 U10.5

Pads without a net: J2 7; U1 14 15 16 22 23 24 25 26 27 30 31 32 33 34 35 38 39 46 47 50 51 53 55 56 57; U7 2 3 4 39 40 41 45 46; U13 5

## Via types
v1: diameter 0.635, hole 0.381, Top Layer to Bottom Layer, 350 vias

## Routing (per net, layer and track width the routed paths; a pad name or vN(x,y) marks a point on that pad's centre or on a via; arc(x,y) is an arc through that point)
1V8: length 160.9
  Top Layer w0.254: U1.19 v1(40.38,6.43) ; v1(21.69,39.88) 23.07,39.88 23.09,39.9 ; v1(51.51,9.83) 50.92,9.83 50.39,9.3 C10.1 49.02,8.23 47.17,10.08 45.21,10.08 44.88,9.75 U1.28 ; v1(41.07,21.89) C13.1 ; U1.43 v1(50.8,15.4) ; C12.1 52.24,21.27 50.32,23.19 v1(49.1,23.19) ; v1(34.21,4.95) 35.63,4.95 C11.1 arc(35.7,5.02) 35.71,5.04 v1(35.71,6.43) ; v1(39.47,21.59) 39.88,21.18 U1.63 39.88,18.62 v1(40.21,18.29) ; v1(47.4,23.16) C14.1 45.97,22.15 45.62,21.79 45.1,21.79 44.38,21.08 U1.54 ; C15.1 32.95,15.4 v1(35.03,15.4) U1.6 ; v1(28.37,25.98) v1(28.37,23.32) ; 52.19,20.32 52.16,20.35 v1(50.8,20.35)
  Top Layer w0.508: 23.09,39.9 27.44,39.9 arc(27.56,39.95) C24.1 arc(27.62,40.04) 27.65,40.03 31.93,40.03 arc(32.34,40.2) 32.51,40.61 U6.2
  Bottom Layer w0.254: v1(50.8,20.35) v1(50.8,15.4) 50.85,15.4 51.51,14.73 v1(51.51,9.83) 51.51,7.14 50.7,6.32 45.06,6.32 43.69,4.95 v1(34.21,4.95) ; v1(28.37,23.32) 28.37,20.09 29.92,18.54 34.49,18.54 35.03,18.01 v1(35.03,15.4) ; v1(40.38,6.43) v1(35.71,6.43) ; v1(21.69,39.88) 21.69,27.36 23.04,26.01 28.41,26.01 ; 28.41,26.01 32.84,26.01 37.26,21.59 v1(39.47,21.59) 40.77,21.59 v1(41.07,21.89) 41.07,27.31 41.63,27.86 44.65,27.86 45.62,26.9 45.62,24.57 47.04,23.16 v1(47.4,23.16) 47.43,23.19 v1(49.1,23.19) ; 28.41,26.01 28.38,25.98
3V3: length 426.7
  Top Layer w0.254: C6.1 41.82,6.72 41.38,7.16 U1.21 ; v1(52.27,18.54) 52.27,17.32 C2.1 51.1,17.29 50.21,16.4 U1.45 ; U7.9 43.02,40.98 42.7,41.3 C32.1 ; U7.1 47.03,39.93 48.51,39.93 48.79,40.21 49.92,40.21 C30.1 50.06,38.79 49.71,38.44 U7.48 ; C3.1 38.66,8.13 arc(38.74,8.32) 38.93,8.4 U1.17 ; U1.42 50.35,14.9 50.73,14.52 C5.1 ; C31.1 37.3,32.94 U7.24 ; U7.36 47.02,30.55 47.37,30.2 47.37,28.87 C29.1 46.24,28.82 v1(46.23,28.83) ; v1(53.72,10.21) 53.03,10.21 52.24,11.01 C7.1 51.13,11.76 50.62,12.27 50.62,13.51 50.24,13.9 U1.40 ; U1.12 34.8,12.4 arc(34.53,12.29) 34.42,12.01 34.42,9.76 arc(34.42,9.76) 34.42,9.75 ; C8.1 38.81,20.23 39.14,19.9 U1.64 39.38,17.66 arc(39.3,17.48) 39.12,17.4 37.38,17.4 arc(37.38,17.4) 37.38,17.4 35.69,17.4 35.21,17.87 C1.1 ; C9.1 44.97,6.09 45.38,6.49 U1.29 ; 38.66,5.01 arc(38.66,5.01) 38.66,5.01
  Top Layer w0.508: v1(37.49,53.15) R11.2 arc(36.03,53.18) 36,53.19 30.99,53.19 arc(30.44,52.96) 30.21,52.41 U6.3 arc(30.2,48.07) 30.19,48.07 C22.1 arc(27.57,48.05) 27.55,48.03 C23.1 arc(23.09,48.04) 23.09,48.05 U5.4 ; 32.66,9.75 32.66,1.55 arc(32.83,1.15) 33.22,0.99 39.65,0.99 arc(40.06,1.16) 40.23,1.57 40.23,4.64 ; 32.66,9.75 v1(32.66,11.68) ; 32.66,9.75 34.43,9.75 arc(34.44,9.75) C4.1 ; 20.08,26.6 C38.2 v1(18.75,26.11) ; 20.08,26.6 20.08,28.96 U11.8 ; 20.08,26.6 arc(20.1,26.59) 20.12,26.56 20.12,25.09 arc(20.29,24.67) 20.71,24.5 24.18,24.5 ; 39.86,5.01 40.6,5.01 ; 39.86,5.01 C3.1 ; 39.86,5.01 arc(40.13,4.9) 40.23,4.64 ; 40.6,5.01 C6.1 C9.1 v1(46.56,5.01) ; 40.6,5.01 arc(40.34,4.9) 40.23,4.64 ; R19.2 15.12,34.92 v1(11.66,34.92) ; 24.18,24.5 24.21,24.5 arc(24.66,24.31) 24.85,23.86 ; 24.18,24.5 arc(24.65,24.7) 24.85,25.17 ; v1(55.78,31.55) 55.78,32.68 R15.1 ; R17.2 21.7,34.77 v1(19.33,34.77) 15.28,34.77 15.13,34.62 ; 24.91,23.19 24.95,23.19 R9.2 27.37,23.17 28.32,22.23 C27.1 C26.1 32.66,22.2 32.66,17.88 v1(32.67,17.87) C1.1 ; 24.91,23.19 v1(23.6,23.19) ; 24.91,23.19 arc(24.87,23.23) 24.85,23.29 24.85,23.86 ; R8.2 v1(23.6,19.42) ; 24.85,23.86 24.85,25.17 ; R5.2 v1(23.6,15.67) ; C32.1 38.46,41.33 v1(38.46,43.87) ; 44.73,58 44.73,51.92 arc(44.94,51.4) 45.46,51.19 C37.2 54.29,51.19 arc(54.3,51.2) U10.8 v1(54.31,48.11) ; v1(51.41,40) 51.06,40.35 C30.1 ; C20.1 v1(19.33,39.65) ; R6.2 v1(11.65,29.16) ; 24.85,25.17 R18.1 ; v1(4.14,15.37) 4.14,5.74 arc(4.13,5.73) R7.2 ; C8.1 38.07,22.98 37.47,23.59 37.47,25.35 35.33,27.48 35.33,32.18 35.93,32.78 C31.1 ; C2.1 C5.1 C7.1 ; U5.2 U5.4 ; U5.4 arc(23.04,50.94) 22.92,50.89 C18.1 19.26,46.79 arc(19.31,46.67) 19.43,46.62 ; v1(23.6,11.94) 24.95,11.94 R3.2 ; v1(64.44,48.16) 64.43,48.15 R23.1 v1(62.41,39.98) ; v1(55.75,40) R14.2 ; 44.73,58 arc(44.73,58) 44.73,58
  Bottom Layer w0.254: v1(46.23,28.83) 46.23,26.19 47.02,25.4 51.38,25.4 52.27,24.51 v1(52.27,18.54)
  Bottom Layer w0.508: v1(54.31,48.11) 54.36,48.16 v1(64.44,48.16) ; v1(23.6,23.19) v1(23.6,19.42) v1(23.6,15.67) ; v1(32.66,11.68) 32.66,17.86 arc(32.67,17.87) v1(32.67,17.87) ; 53.72,5.52 53.72,4.6 ; 53.72,5.52 v1(53.72,10.21) ; 53.72,5.52 arc(53.59,5.19) 53.26,5.06 ; 53.72,4.6 53.72,3.16 H1.2 arc(53.72,3.15) 53.72,3.15 53.72,1.52 arc(53.88,1.13) 54.28,0.97 69.22,0.97 arc(69.59,1.12) 69.75,1.5 U12.3 ; 53.72,4.6 arc(53.59,4.92) 53.26,5.06 ; v1(62.41,39.98) 55.78,39.98 ; 55.78,39.98 v1(55.75,40) v1(51.41,40) 51.44,40.03 51.44,43.08 50.65,43.87 v1(38.46,43.87) 37.49,44.83 v1(37.49,53.15) ; 55.78,39.98 v1(55.78,31.55) ; H2.10 1.73,39.29 1.73,37.57 2.31,36.98 10.52,36.98 11.66,35.84 v1(11.66,34.92) 11.66,29.16 ; v1(23.6,15.67) v1(23.6,11.94) ; v1(23.6,15.67) 21.49,15.67 20.52,16.64 J2.4 18.62,16.64 J2.5 v1(4.14,15.37) ; v1(46.56,5.01) 46.61,5.06 53.26,5.06 ; v1(18.75,26.11) 18.75,33.12 19.36,33.73 19.36,34.75 v1(19.33,34.77) v1(19.33,39.65)
GND: length 176
  Top Layer w0.254: U1.13 35.9,11.9 v1(35.56,11.56) ; v1(50.34,37.92) 48.54,37.92 U7.47 ; v1(46.84,32.97) 46.52,32.65 U7.35 ; U1.3 38.7,16.9 v1(38.99,16.61) ; v1(40.11,13.59) 39.8,13.9 U1.9 ; v1(43.81,42.44) 43.64,42.62 v1(42.62,42.62) 41.96,42.62 v1(41.57,43.01) C34.1 41.57,45.32 40.89,46 v1(40.89,47.38) v1(40.89,48.19) 40.89,49.4 41.4,49.91 v1(42.52,49.91) v1(43.51,49.91) v1(44.39,49.91) v1(45.38,49.91) v1(46.39,49.91) v1(47.38,49.91) 47.88,49.91 48.46,49.33 v1(48.46,48.68) v1(48.46,47.75) 48.46,46.58 47.93,46.05 47.93,44.16 C33.1 47.87,43.22 v1(47.14,42.49) v1(46.1,42.49) 45.82,42.22 v1(45.82,41.55) ; 28.52,12.57 v1(27.15,11.2) 27.15,9.17 26.64,8.66 26.03,8.66 24.94,7.56 C16.1 24.84,6.51 24.84,5.46 24.1,4.72 24.1,1.24 24.61,0.74 v1(28.5,0.74) 30.94,0.74 31.52,1.32 31.52,6.4 C17.1 31.32,7.72 v1(31.01,8.03) v1(30.28,8.76) v1(30.28,10.92) v1(31.04,11.68) ; v1(40.44,32.06) 40.69,32.06 41.45,32.82 41.45,33.17 41.19,33.44 U7.23 ; U7.8 43.52,39.05 v1(44.09,38.48) ; U1.44 v1(47.12,15.9) ; C13.2 41.07,26.34 40.77,26.64 v1(40.77,28.32) ; U1.48 v1(47.14,17.9) ; U1.37 v1(47.12,12.4) ; U1.41 v1(47.12,14.4) ; U1.20 40.88,9.9 arc(40.8,10.08) 40.61,10.16 40.13,10.16 arc(39.95,10.09) 39.88,9.91 39.88,8.4 ; 39.88,8.4 arc(39.88,8.4) 39.88,8.4
  Top Layer w0.508: C26.2 v1(32.69,26.92) ; R4.2 v1(36.25,24.46) ; v1(29.44,15.47) 29.46,15.44 C15.2 ; C32.2 v1(36.49,39.52) ; C1.2 v1(34.11,21.36) ; C11.2 v1(37.16,3.01) C3.2 ; C36.2 v1(59.52,13.54) ; U9.8 v1(60.1,21.62) ; C24.2 v1(27.61,43.89) ; C19.2 v1(15.62,58.45) ; C42.1 v1(62.09,4.23) C40.1 ; C39.2 v1(62.32,10.91) R22.2 ; C10.2 52.38,8.21 v1(52.38,7.06) ; C29.2 v1(49.42,30.76) ; C14.2 45.87,25.05 v1(44.66,25.05) R1.2 ; C28.2 v1(41,53.17) ; C35.2 v1(60.26,16.92) ; U10.3 U10.4 ; U10.3 U10.2 ; U10.3 v1(56.84,44.17) ; C27.2 v1(30.24,26.87) ; R16.2 v1(29.84,32.21) ; 54.44,20.32 54.24,20.12 v1(54.24,18.8) C2.2 v1(54.24,15.82) C5.2 54.25,14.51 v1(54.25,13.13) 54.25,11.78 C7.2 ; U10.2 v1(55.57,44.17) ; U10.2 U10.1 ; U13.2 v1(63.36,54.23) ; C18.2 v1(17.26,49.66) ; U10.7 v1(55.57,49.66) ; v1(36.25,47.98) 34.88,47.98 U6.1 ; C38.1 22.08,27.1 v1(22.78,27.81) ; C8.2 38.94,25.1 v1(38.94,26.42) ; R20.1 v1(16.71,28.95) ; v1(15.14,46.66) 16.55,46.66 arc(16.58,46.65) C20.2 ; v1(24.44,45.3) C23.2 23.1,42.65 arc(23.1,42.64) C25.2 ; C41.2 v1(65.91,57.78) ; v1(49.94,49.22) 51.43,49.22 C37.1 ; C6.2 v1(43.31,3.01) C9.2 ; C31.2 v1(37.13,29.18) ; v1(6.15,56.57) 7.84,56.57 arc(7.89,56.55) C21.2 ; C22.2 v1(27.58,51.92) ; v1(17.73,32.84) 20.01,32.84 arc(20.04,32.83) U11.5 ; C4.2 v1(35.87,7.74) ; U5.1 v1(26.7,57)
  Bottom Layer w0.254: v1(30.28,10.92) 30.28,10.82 ; v1(30.28,8.76) 30.28,8.81 ; v1(26.16,8.66) 26.09,8.66 26.03,8.71 ; v1(38.99,16.61) 38.99,16.64 ; v1(27.15,11.2) 27.15,11.18
  vias: v1(1.17,17.09) v1(1.17,15.65) v1(1.17,10.87) v1(1.17,9.42) v1(1.55,22.78) v1(1.55,21.34) v1(2.82,17.09) v1(2.82,15.65) v1(2.82,10.87) v1(2.82,9.42) v1(3.2,22.78) v1(3.2,21.34) v1(4.22,51.23) v1(4.22,49.78) v1(4.18,47.3) v1(4.18,45.85) v1(4.74,54.9) v1(4.74,53.45) v1(5.83,47.3) v1(5.83,45.85) v1(5.87,51.23) v1(5.87,49.78) v1(6.39,54.9) v1(6.39,53.45) v1(15.9,55.14) v1(15.9,53.7) v1(17.55,55.14) v1(17.55,53.7) v1(19.02,53.34) v1(19.76,58.98) v1(20.19,53.37) v1(20.35,22.68) v1(20.42,54.64) v1(21.39,53.11) v1(21.46,54.58) v1(23.99,3.73) v1(23.99,2.67) v1(24.03,1.75) v1(24.21,54.58) v1(24.23,53.06) v1(24.17,5.02) v1(24.27,0.88) v1(25.32,8.18) v1(25.6,54.64) v1(25.6,53.19) v1(25.84,0.67) v1(26.85,19.33) v1(26.92,15.04) v1(27.25,54.64) v1(27.25,53.19) v1(27.32,0.7) v1(28.42,45.59) v1(28.45,44.3) v1(28.5,57.48) v1(28.5,56.03) v1(28.47,17.88) v1(28.5,12.6) v1(29.74,42.39) v1(29.77,0.71) v1(30.1,45.57) v1(30.1,44.3) v1(30.15,57.48) v1(30.15,56.03) v1(30.96,0.76) v1(31.2,5.31) v1(31.44,45.67) v1(31.39,44.53) v1(31.53,4.38) v1(31.5,3.56) v1(31.46,1.49) v1(31.57,49.91) v1(31.6,2.49) v1(31.95,57.38) v1(31.95,55.93) v1(33.48,39.6) v1(33.48,28.27) v1(33.6,57.38) v1(33.6,55.93) v1(33.71,45.92) v1(33.71,44.48) v1(33.96,50.19) v1(34.8,40.33) v1(35.36,45.92) v1(35.36,44.48) v1(38.46,56.46) v1(38.51,39.47) v1(38.58,58.24) v1(40.89,49.1) v1(40.89,46.19) v1(41.35,49.75) v1(41.48,45.42) v1(41.68,56.24) v1(42.32,12.78) v1(42.32,11.33) v1(42.98,15.93) v1(42.98,14.48) v1(43.33,6.48) v1(43.97,12.78) v1(43.97,11.33) v1(44.63,15.93) v1(44.63,14.48) v1(47.32,21.64) v1(48,45.9) v1(48.28,49.51) v1(48.46,46.8) v1(50.65,46.56) v1(50.65,45.11) v1(52.3,46.56) v1(52.3,45.11) v1(53.19,58.42) v1(53.19,56.97) v1(54.84,58.42) v1(54.84,56.97) v1(55.25,24.03) v1(55.6,42.8) v1(55.6,41.35) v1(56.39,26.9) v1(57.25,42.8) v1(57.25,41.35) v1(57.56,33.63) v1(57.81,58.42) v1(57.81,56.97) v1(59,36.6) v1(59.46,58.42) v1(59.46,56.97) v1(60.05,54.05) v1(62.99,36.32) v1(63.88,41.33) v1(63.88,39.88) v1(65.53,41.33) v1(65.53,39.88) v1(66.75,49.71) v1(66.75,48.26) v1(67.59,40.21) v1(67.59,38.76) v1(68.4,49.71) v1(68.4,48.26) v1(69.06,58.55) v1(69.06,57.1) v1(69.24,40.21) v1(69.24,38.76) v1(70.71,58.55) v1(70.71,57.1) v1(73.53,49.91) v1(73.53,48.46) v1(73.76,58.42) v1(73.76,56.97) v1(74.04,18.62) v1(74.04,17.17) v1(74.73,40.28) v1(74.73,38.84) v1(75.18,49.91) v1(75.18,48.46) v1(75.41,58.42) v1(75.41,56.97) v1(75.69,18.62) v1(75.69,17.17) v1(76.38,40.28) v1(76.38,38.84) v1(78.54,30.73) v1(78.54,29.29) v1(78.51,6.86) v1(78.51,5.41) v1(80.24,58.45) v1(80.24,57) v1(80.19,30.73) v1(80.19,29.29) v1(80.16,6.86) v1(80.16,5.41) v1(80.92,38.61) v1(80.92,37.16) v1(80.97,50.11) v1(80.97,48.67) v1(81.18,13.84) v1(81.18,12.39) v1(81.31,2.54) v1(81.31,1.09) v1(81.82,24.39) v1(81.82,22.94) v1(81.89,58.45) v1(81.89,57) v1(82.63,50.11) v1(82.63,48.67) v1(82.58,38.61) v1(82.58,37.16) v1(82.83,13.84) v1(82.83,12.39) v1(82.96,2.54) v1(82.96,1.09) v1(83.47,24.39) v1(83.47,22.94)
PGND: length 20.7
  Top Layer w0.762: J2.SH1 J2.SH2 14.06,3.18 TP1.1
BOOT0: length 7.7
  Top Layer w0.254: U7.44 51.78,36.44 52.76,37.41 52.76,40.45 R10.2
DC: length 166.7
  Top Layer w0.508: 70.35,34.77 71.36,34.77 ; 70.35,34.77 69.2,34.77 ; 70.35,34.77 arc(69.94,34.6) 69.77,34.2 ; 71.36,34.77 K1.1 ; 71.36,34.77 arc(71.37,34.78) 71.37,34.79 v1(71.37,34.8) ; C19.1 17.06,56.45 17.6,57 U5.3 20.79,58.7 arc(20.94,59.06) 21.3,59.21 39.37,59.21 arc(39.62,59.1) 39.73,58.85 v1(39.73,55.32) ; K4.1 69.77,34.2 ; 69.77,34.2 arc(69.61,34.6) 69.2,34.77 ; U13.3 v1(61.44,55.32) ; C21.1 14,56.5 arc(14.07,56.47) 14.1,56.4 ; 69.2,34.77 K2.1 ; K3.1 73.58,10.97 arc(73.43,10.6) 73.05,10.44 67.26,10.44 arc(66.83,10.62) 66.65,11.05 66.65,13.97 arc(66.43,14.51) 65.89,14.73 62.27,14.73 arc(62.26,14.74) C36.1 arc(62.26,14.75) 62.26,14.75 C35.1 63.19,18.26 arc(63.57,18.42) 63.73,18.8 63.73,21.61 arc(63.73,21.61) U9.9
  Top Layer w0.635: U13.3 62.41,57.67 arc(62.38,57.75) C41.1 ; DC1.4 11.66,49.73 arc(10.96,50.02) 10.67,50.72 10.67,56.48 arc(10.66,56.49) C21.1
  Bottom Layer w0.508: v1(71.37,34.8) 71.37,54.89 arc(71.25,55.19) 70.94,55.32 v1(61.44,55.32) v1(39.73,55.32) ; K3.1 76.48,12.5 arc(77.02,12.72) 77.24,13.26 77.24,34.11 arc(77.05,34.58) 76.58,34.77 K1.1 arc(73.6,34.74) 73.63,34.72
ETH_CS: length 12
  Top Layer w0.254: U1.59 41.88,21.56 42.29,21.97 42.29,26.19 41.52,26.96 U7.25
ETH_INT#: length 15.1
  Top Layer w0.254: U1.49 48.03,19.9 48.36,20.23 48.36,27.23 48.18,27.41 46.58,27.41 45.02,28.97 U7.32
ETH_RSTI: length 27.1
  Top Layer w0.254: v1(47.55,24.18) 47.55,26.31 47.02,26.85 46.33,26.85 44.42,28.75 44.42,29.62 43.52,30.52 U7.29 ; U1.36 50.15,11.9 50.5,11.56 v1(50.5,11)
  Bottom Layer w0.254: v1(50.5,11) 50.5,13.69 49.84,14.35 49.84,23.7 49.38,24.16 47.57,24.16 v1(47.55,24.18)
ETH_SCK: length 16
  Top Layer w0.254: U1.60 41.38,18.67 v1(41.71,18.34) ; U7.26 42.02,27.98 42.98,27.03 v1(42.98,26.44)
  Bottom Layer w0.254: v1(42.98,26.44) 42.49,26.44 42.34,26.29 42.34,18.97 v1(41.71,18.34)
ETH_SDI: length 19.5
  Top Layer w0.254: U1.61 40.89,19.88 40.89,17.98 41.22,17.65 43.69,17.65 v1(43.76,17.73) ; U7.28 43.02,29.88 43.74,29.16 43.74,27.76 44.4,27.1 v1(44.4,26.64)
  Bottom Layer w0.254: v1(43.76,17.73) 43.74,17.75 43.74,25.98 v1(44.4,26.64)
ETH_SDO: length 15.5
  Top Layer w0.254: v1(39.93,29.13) 39.93,22.11 40.38,21.66 U1.62 ; U7.27 42.52,28.88 v1(42.82,28.58)
  Bottom Layer w0.254: v1(39.93,29.13) 42.27,29.13 v1(42.82,28.58)
K11: length 12.8
  Top Layer w0.254: CN1.1 84.61,46.94 84.61,45.44 84.1,44.93 K1.3
K12: length 11.2
  Top Layer w0.254: CN1.2 76.76,52.1 76.28,52.58 73.61,52.58 K1.4
K21: length 27.3
  Top Layer w0.254: K2.3 66.6,42.32 67.28,41.63 77.67,41.63 78.89,40.41 78.89,34.77 79.79,33.88 CN2.1
K22: length 38.6
  Top Layer w0.254: CN2.2 86.02,38.95 86.74,39.67 86.74,53.82 86.21,54.36 66.95,54.36 66.6,54 K2.4
K31: length 11.7
  Top Layer w0.254: CN3.1 81.81,20.73 79.88,22.66 K3.3
K32: length 14.9
  Top Layer w0.254: K3.4 73.58,26.7 74.46,25.81 CN3.2
K41: length 25.9
  Top Layer w0.254: K4.3 78.84,20.12 79.96,19 79.96,8.86 81.23,7.59 CN4.1
K42: length 19.8
  Bottom Layer w0.254: K4.4 69.77,10.31 70.38,9.7 83.87,9.7 84.53,10.36 CN4.2
LINK#: length 59
  Top Layer w0.254: J2.10 J2.11 ; U1.52 45.38,17.36 44.86,16.84 v1(41.99,16.84)
  Bottom Layer w0.254: J2.10 7.74,20.08 8.25,20.6 8.25,25.27 8.76,25.78 16.54,25.78 17.75,24.56 32.87,24.56 40.59,16.84 v1(41.99,16.84)
M_C: length 38
  Top Layer w0.254: U7.34 46.02,32.51 v1(45.72,32.82) ; R13.2 52.45,5.92 55.75,9.22 55.75,21.46 55.5,21.72 52.81,21.72 49.3,25.22 v1(49.3,27.1)
  Bottom Layer w0.254: v1(49.3,27.1) 49.3,29.64 48.16,30.78 46.94,30.78 45.72,32 v1(45.72,32.82)
M_D: length 34.1
  Top Layer w0.254: U7.37 50.12,32.94 50.67,32.39 50.67,25.04 53.44,22.28 56.08,22.28 56.41,21.95 56.41,21.36 57.1,20.67 57.1,9.42 54.63,6.95 R12.2
M_DIR: length 23.7
  Top Layer w0.254: U11.3 U11.2 28.33,30.25 R16.1 30.42,30.21 v1(30.45,30.25) ; U7.33 45.52,29.99 v1(45.85,29.67)
  Bottom Layer w0.254: v1(30.45,30.25) 41.02,30.25 41.6,29.67 v1(45.85,29.67)
M_IO_PA4: length 30.2
  Top Layer w0.254: U7.14 32.8,37.94 v1(32.36,38.38)
  Bottom Layer w0.254: H2.1 27.64,41.86 30.18,39.32 30.18,38.63 30.43,38.38 v1(32.36,38.38)
M_IO_PA5: length 35.6
  Top Layer w0.254: U7.15 31.4,37.44 31.12,37.72 v1(31.12,39.14)
  Bottom Layer w0.254: H2.3 9.32,43.18 9.8,43.66 26.59,43.66 v1(31.12,39.14)
M_IO_PA6: length 36
  Top Layer w0.254: U7.16 30.4,36.94 29.24,38.1 v1(29.24,38.79)
  Bottom Layer w0.254: v1(29.24,38.79) 29.24,38.84 27.51,40.56 7.52,40.56 6.78,41.3 H2.5
M_IO_PA7: length 38.5
  Top Layer w0.254: H2.7 4.24,41 4.67,40.56 13.33,40.56 15.67,38.23 28.12,38.23 29.91,36.44 U7.17
M_IO_PB1: length 30.3
  Top Layer w0.254: H2.2 11.86,38.38 12.47,37.77 27.51,37.77 29.84,35.44 U7.19
M_IO_PB2: length 33.5
  Top Layer w0.254: H2.4 9.35,39.29 9.35,37.64 9.78,37.21 27.05,37.21 29.32,34.94 U7.20
M_IO_PB10: length 36.4
  Top Layer w0.254: H2.6 6.78,37.39 7.44,36.73 26.49,36.73 28.78,34.44 U7.21
M_IO_PB11: length 39.3
  Top Layer w0.254: U7.22 28.37,33.94 26.03,36.27 5.13,36.27 4.24,37.16 H2.8
M_K1: length 23.5
  Top Layer w0.254: U7.10 42.52,39.09 43.94,37.67 v1(45.75,37.67) ; v1(54.71,29.39) 54.86,29.24 U9.2 U9.1
  Bottom Layer w0.254: v1(45.75,37.67) 49.1,37.67 54.71,32.06 v1(54.71,29.39)
M_K2: length 24.9
  Top Layer w0.254: U7.11 42.02,38.8 44.02,36.8 v1(44.83,36.8) ; U9.4 U9.3 54.33,27.97 53.44,28.85 v1(53.44,29.52)
  Bottom Layer w0.254: v1(44.83,36.8) 48.54,36.8 53.44,31.9 v1(53.44,29.52)
M_K3: length 27.8
  Top Layer w0.254: U7.12 41.52,38.51 44.02,36.02 v1(44.04,36.02) ; v1(52.58,30.35) 52.58,26.52 53.67,25.43 U9.5 U9.6
  Bottom Layer w0.254: v1(52.58,30.35) 52.58,31.6 48.16,36.02 v1(44.04,36.02)
M_K4: length 28.2
  Top Layer w0.254: v1(43.05,35.33) 43.05,35.96 41.45,37.56 41.45,37.92 40.94,38.44 U7.13 ; U9.7 54.53,22.89 51.33,26.09 v1(51.33,31.06)
  Bottom Layer w0.254: v1(51.33,31.06) 47.19,35.2 43.18,35.2 v1(43.05,35.33)
M_KC1: length 17.6
  Top Layer w0.254: K1.2 73.58,36.32 arc(73.49,36.11) 73.28,36.02 64.19,36.02 arc(63.86,35.88) 63.72,35.55 U9.16 U9.15
M_KC2: length 16.5
  Top Layer w0.254: K2.2 62.59,37.31 arc(62.57,37.31) 62.56,37.29 arc(62.17,37.12) 62,36.73 62,28.47 arc(62.15,28.11) 62.51,27.97 U9.14 U9.13
M_KC3: length 20.8
  Top Layer w0.254: U9.11 U9.12 v1(68.07,25.43)
  Bottom Layer w0.254: K3.2 69.27,15.04 68.07,16.23 v1(68.07,25.43)
M_KC4: length 10.5
  Top Layer w0.254: U9.10 69.14,22.89 69.77,23.52 K4.2
M_RST#: length 17.9
  Top Layer w0.254: R11.1 39.17,51.15 C28.1 39.19,43.46 40.79,41.86 43.33,41.86 44.02,41.17 U7.7
M_RXD: length 29.5
  Top Layer w0.254: v1(32.54,32.44) 32.54,29.52 31.95,28.93 25.64,28.93 U11.1 25.59,28.35 arc(25.69,28.13) 25.91,28.04 26.52,28.04 arc(26.73,27.95) 26.82,27.74 26.82,26.15 arc(26.83,26.13) R18.2 ; U7.31 44.52,33.76 44.53,33.76 v1(44.53,33.81)
  Bottom Layer w0.254: v1(32.54,32.44) 32.54,33.53 32.82,33.81 v1(44.53,33.81)
M_SCL: length 46.3
  Top Layer w0.254: OLED1.3 47.27,54.25 48.03,53.49 56.19,53.49 56.84,52.83 U10.6 v1(56.84,49.33) ; U7.42 53.28,35.44 54.02,34.71 R15.2 58.48,34.71 60.12,36.35 v1(60.12,49.38)
  Bottom Layer w0.254: v1(56.84,49.33) 60.07,49.33 v1(60.12,49.38)
M_SDA: length 40
  Top Layer w0.254: OLED1.4 49.81,54.79 50.22,54.38 57.3,54.38 58.12,53.57 U10.5 58.14,51.18 58.8,51.18 59.31,50.67 59.31,38.19 57.71,36.59 R14.1 53.86,36.59 53.21,35.94 U7.43
M_TXD: length 24
  Top Layer w0.254: v1(43.49,33.07) 43.87,33.07 44.02,32.92 U7.30 ; R17.1 23.75,34.82 25.07,34.82 25.59,34.3 U11.4 26.74,32.79 27.41,33.45 34.16,33.45 v1(34.52,33.1)
  Bottom Layer w0.254: v1(43.49,33.07) 34.54,33.07 v1(34.52,33.1)
M_X1: length 9.2
  Top Layer w0.254: U7.5 45.02,40.86 44.98,40.91 44.98,44 45.06,44.09 C33.2 45.87,45.48 46.71,46.33 46.71,47.89 U8.2
M_X2: length 9.3
  Top Layer w0.254: U7.6 44.52,40.86 44.57,40.91 44.57,44 44.48,44.09 C34.2 ; C34.2 43.57,43.94 ; C34.2 43.57,45.33 42.72,46.18 42.72,47.73 42.71,47.75
RXN: length 30.7
  Top Layer w0.254: v1(39.27,15.72) 39.09,15.9 U1.5 ; J2.6 21.46,14.1 21.92,13.64 21.92,10.31 22.35,9.88 24.93,9.88 R3.1 25.01,9.88 v1(26.31,9.88)
  Bottom Layer w0.254: v1(39.27,15.72) 39.22,15.67 39.22,10.18 38.92,9.88 v1(26.31,9.88)
RXP: length 25.7
  Top Layer w0.254: U1.4 34,16.4 33.74,16.65 31.99,16.65 31.65,16.99 v1(30.84,16.99) ; J2.3 20.6,17.91 22.5,16 22.5,14.83 23.67,13.67 R5.1 25,13.64 v1(29.16,13.64)
  Bottom Layer w0.254: v1(29.16,13.64) 30.23,13.64 30.84,14.25 v1(30.84,16.99)
S_CTRL: length 34.2
  Top Layer w0.254: U13.4 62.41,50.15 arc(62.41,50.15) R23.2 61.4,50.15 61.04,49.78 61.04,35.51 56.06,30.53 53.97,30.53 51.07,33.44 U7.38
SEN_OUT: length 51.5
  Top Layer w0.254: v1(41.83,34.65) 41.83,35.36 41.25,35.94 U7.18 ; U12.4 65,6.86 64.29,7.57 64.29,8.85 R22.1 C39.1 57.82,8.91 v1(57.81,8.92)
  Bottom Layer w0.254: v1(57.81,8.92) 57.81,23.57 46.81,34.57 41.99,34.57 41.91,34.65 v1(41.83,34.65)
TXN: length 19.5
  Top Layer w0.254: J2.2 21.66,19.18 23.42,17.42 R8.1 26.29,17.42 29.32,14.4 U1.8
TXP: length 29.5
  Top Layer w0.254: U1.7 v1(40.18,14.9) ; v1(30.91,19.36) 30.1,19.36 28.28,21.17 R9.1 19.52,21.17 18.8,20.45 J2.1
  Bottom Layer w0.254: v1(40.18,14.9) 40.18,16.57 37.4,19.36 v1(30.91,19.36)
V_HU: length 101.5
  Top Layer w0.254: C42.2 C40.2 72.33,2.23 arc(72.68,2.37) 72.82,2.72 72.82,3.73 arc(72.83,3.75) U12.1 ; v1(86.74,55.35) 64.34,55.35 U13.1
  Bottom Layer w0.254: U12.1 85.65,3.76 86.74,4.85 v1(86.74,55.35)
XI: length 19.2
  Top Layer w0.254: U1.10 30.74,13.4 27.76,10.42 27.76,8.84 26.94,8.01 C16.2 26.94,5.68 25.74,4.48 X1.2
XO: length 17.3
  Top Layer w0.254: U1.11 30.96,12.9 29.32,11.26 C17.2 29.32,5.3 29.84,4.78 29.84,2.88 X1.1
$1N6890: length 3.5
  Top Layer w0.254: U1.1 37.38,18.5 36.19,19.69 36.19,20.79 R4.1
$1N7627: length 3.6
  Top Layer w0.254: U1.58 42.38,21.14 43.54,22.3 R1.1
$1N10654: length 5.2
  Top Layer w0.254: R2.1 19.94,11.52 J2.8
$1N10919: length 3.7
  Top Layer w0.254: R7.1 6.12,9.36 J2.12
$1N10952: length 8.4
  Top Layer w0.254: R6.1 6.77,25.87 6.1,25.2 6.1,22.63 J2.9
$2N5291: length 2.9
  Top Layer w0.254: H1.1 56.63,3.51 R12.1
$2N5344: length 2.8
  Top Layer w0.254: H1.4 48.68,3.19 R13.1
$2N14954: length 18
  Top Layer w0.254: 12.06,30.91 15.22,30.91 ; CN5.2 7.34,31.8 11.88,31.8 11.97,31.71 R21.1 ; R20.2 15.91,31.73 16.04,31.73 17.09,30.68 19.97,30.68 20.06,30.59 U11.7
$2N14989: length 17.8
  Top Layer w0.254: CN5.1 7.34,32.2 11.88,32.2 11.97,32.29 R21.2 R19.1 15.91,32.14 16.21,32.14 17.26,31.09 19.97,31.09 20.06,31.18 U11.6

## Copper pours and planes (outline as drawn; the poured copper is in the pictures)
GND on Top Layer: 0,-0.1 4.48,-0.1 4.48,27.03 4.6,27.15 18.66,27.15 18.75,27.07 18.75,0.26 19,0 90.25,0 90.25,60.25 0,60.25
GND on Bottom Layer: 0,-0.1 4.48,-0.1 4.48,27.03 4.6,27.15 18.66,27.15 18.75,27.07 18.75,0.26 19,0 90.25,0 90.25,60.25 0,60.25
PGND on Top Layer: 4.57,26.92 18.31,26.92 18.31,0.35 4.57,0.35
PGND on Bottom Layer: 4.57,26.92 18.31,26.92 18.31,0.35 4.57,0.35

Small or netless copper shapes (teardrops, artwork), in the pictures only: 526 on Top Layer, 83 on Bottom Layer

## Text on the board
Top Silkscreen Layer: GND | 3.3 | B11 | A7 | B10 | A6 | A5 | B2 | A4 | B1 | M_C | M_D
